# EAGLE board AM3352-TI (EAGLE 9.6.2), part 1 of 3
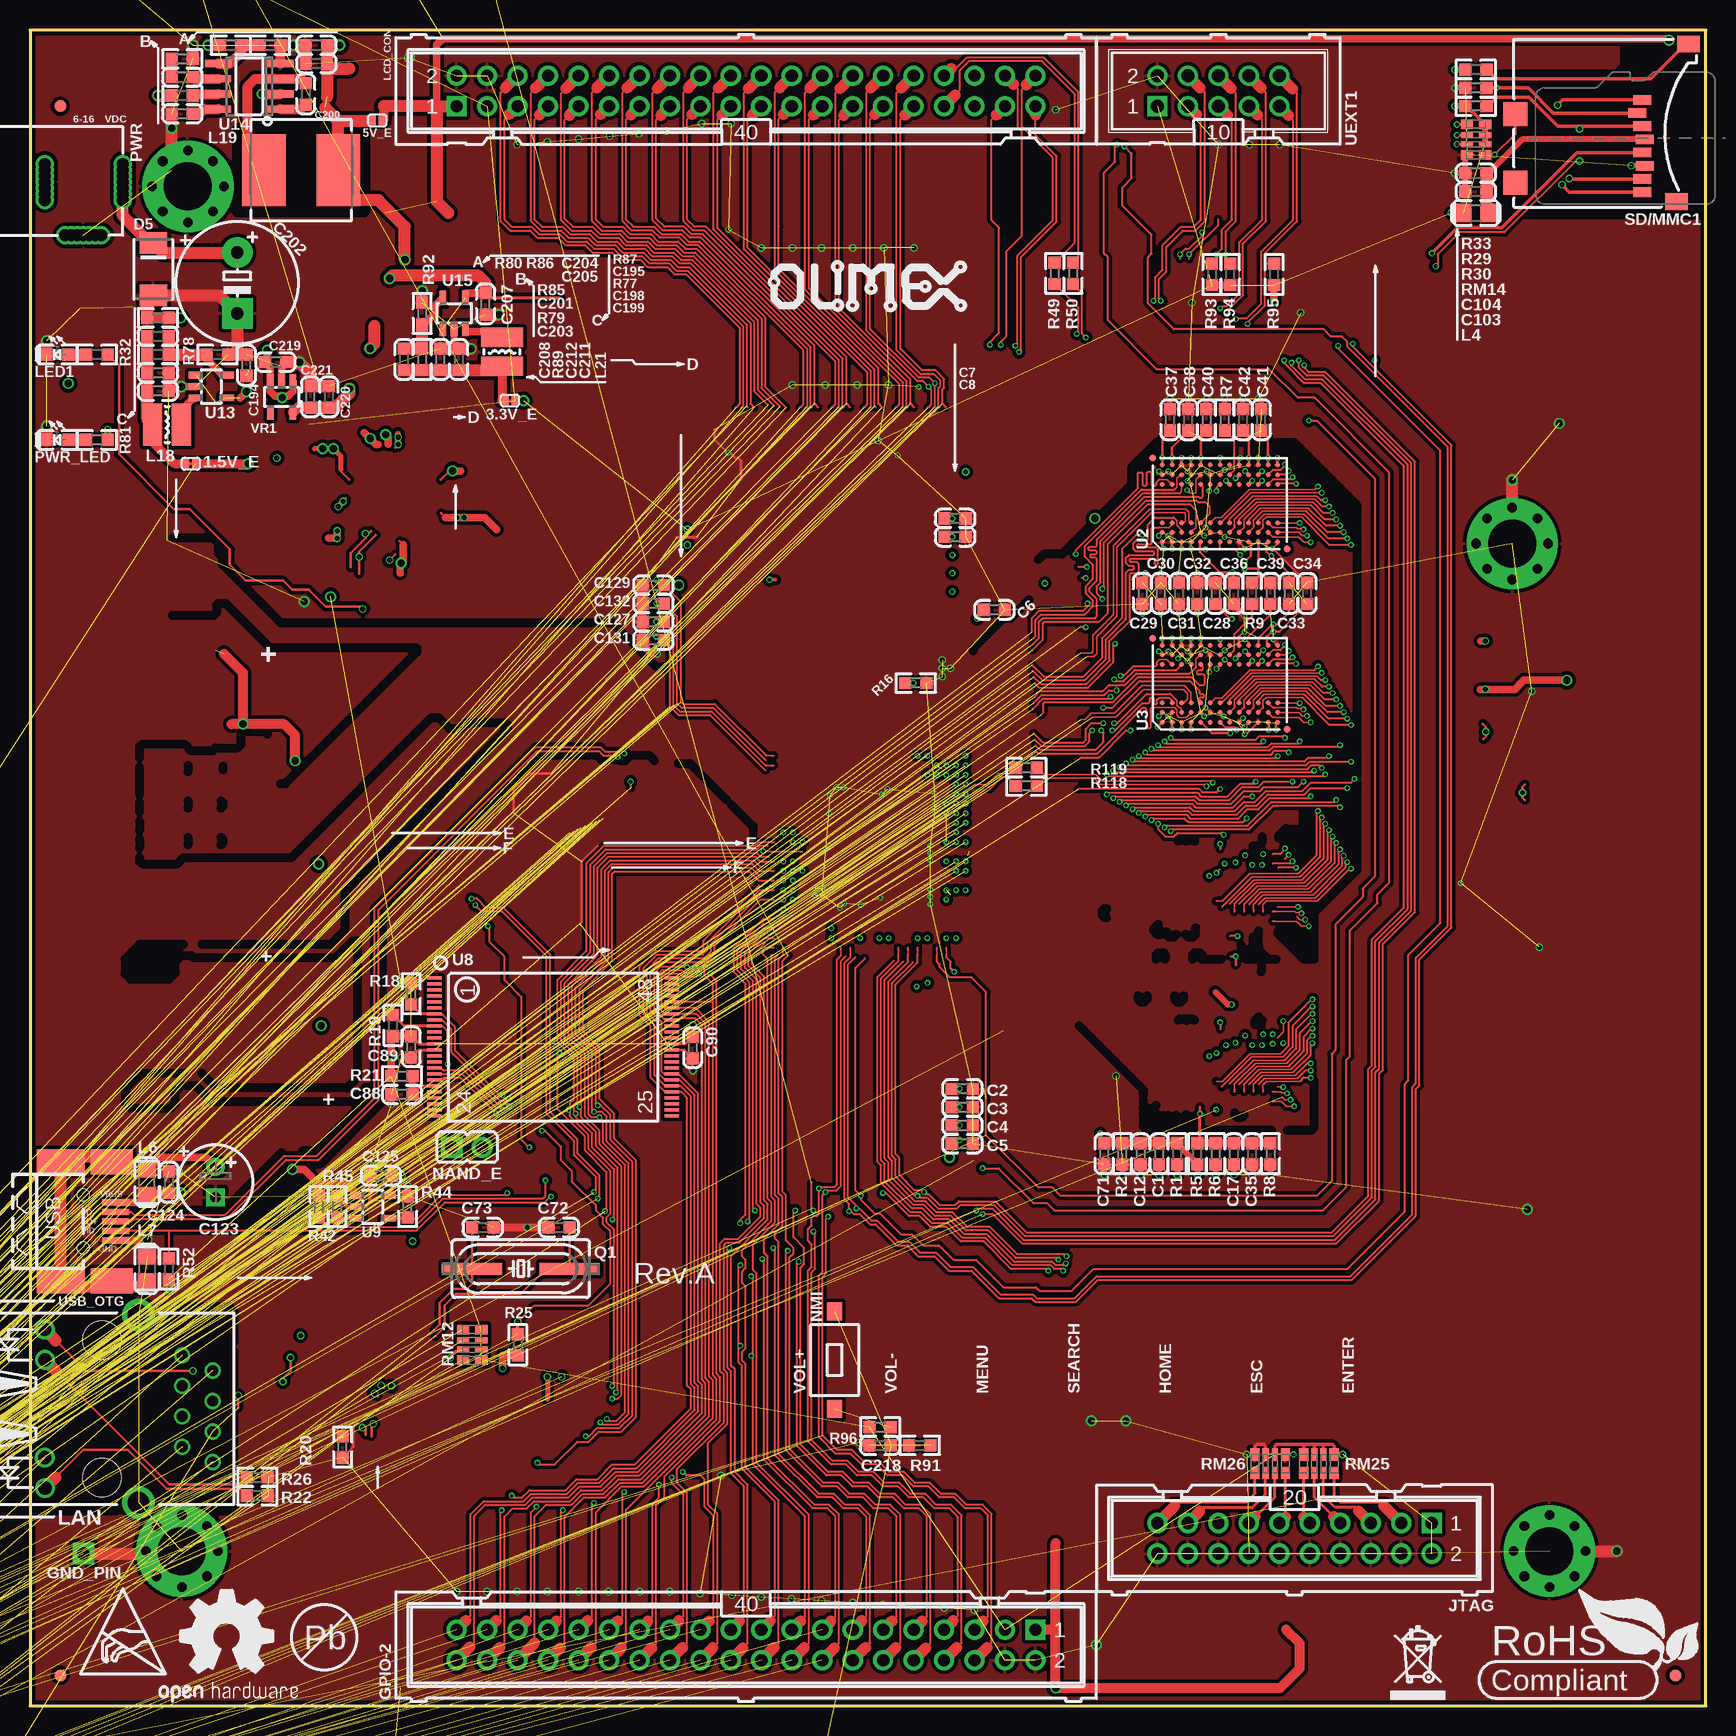
[diagram p5: board, top side]
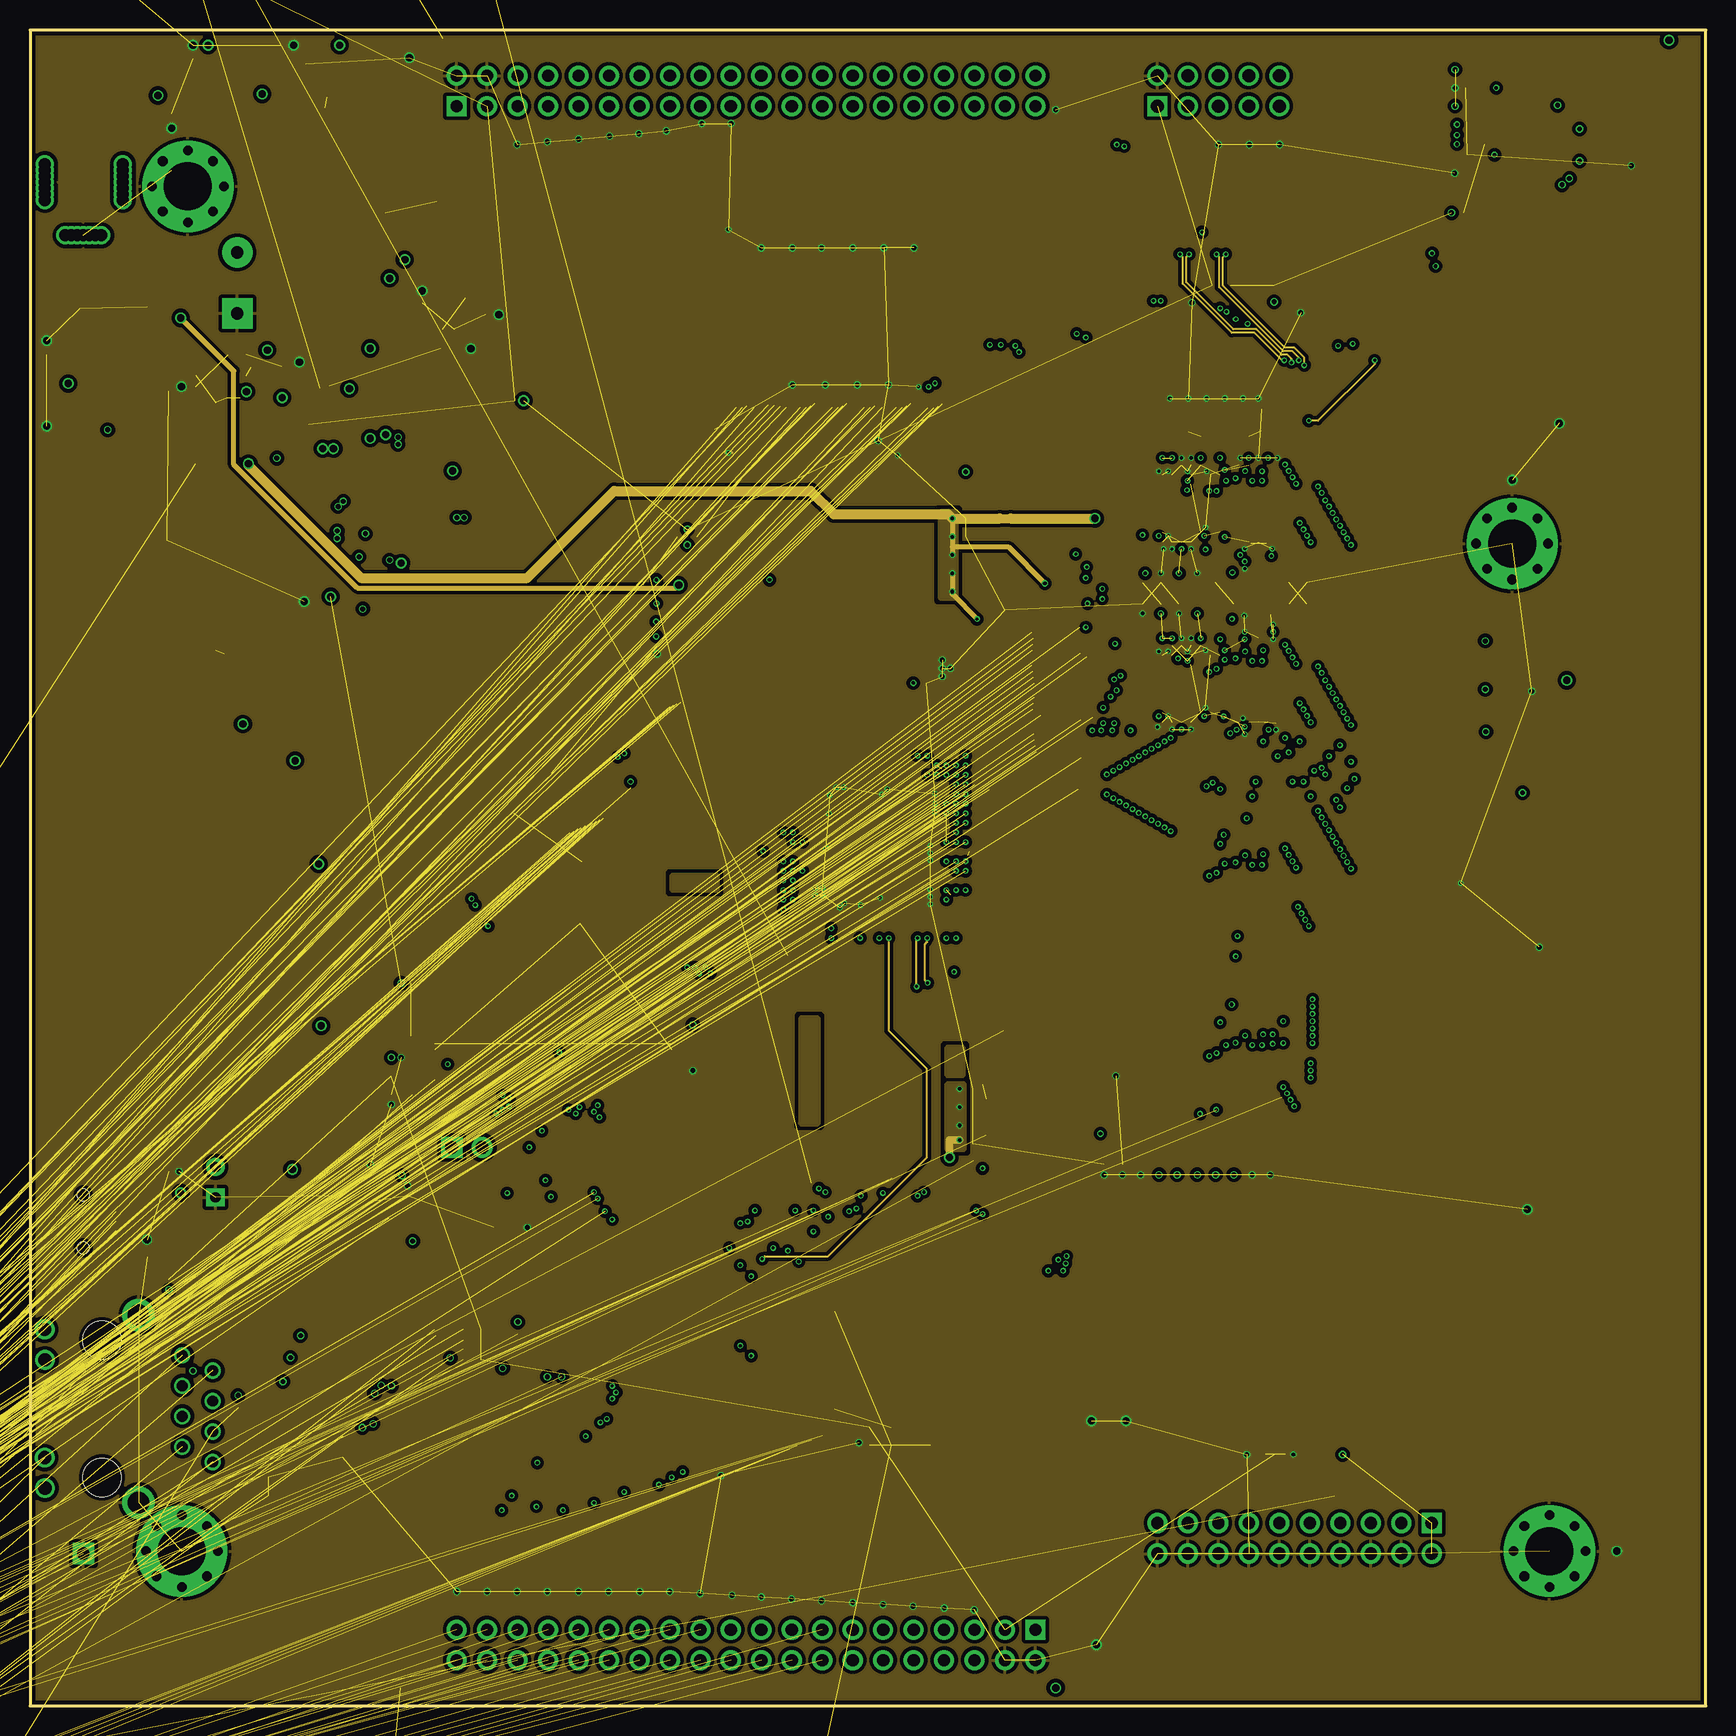
[diagram p6: board, inner layer Route2]
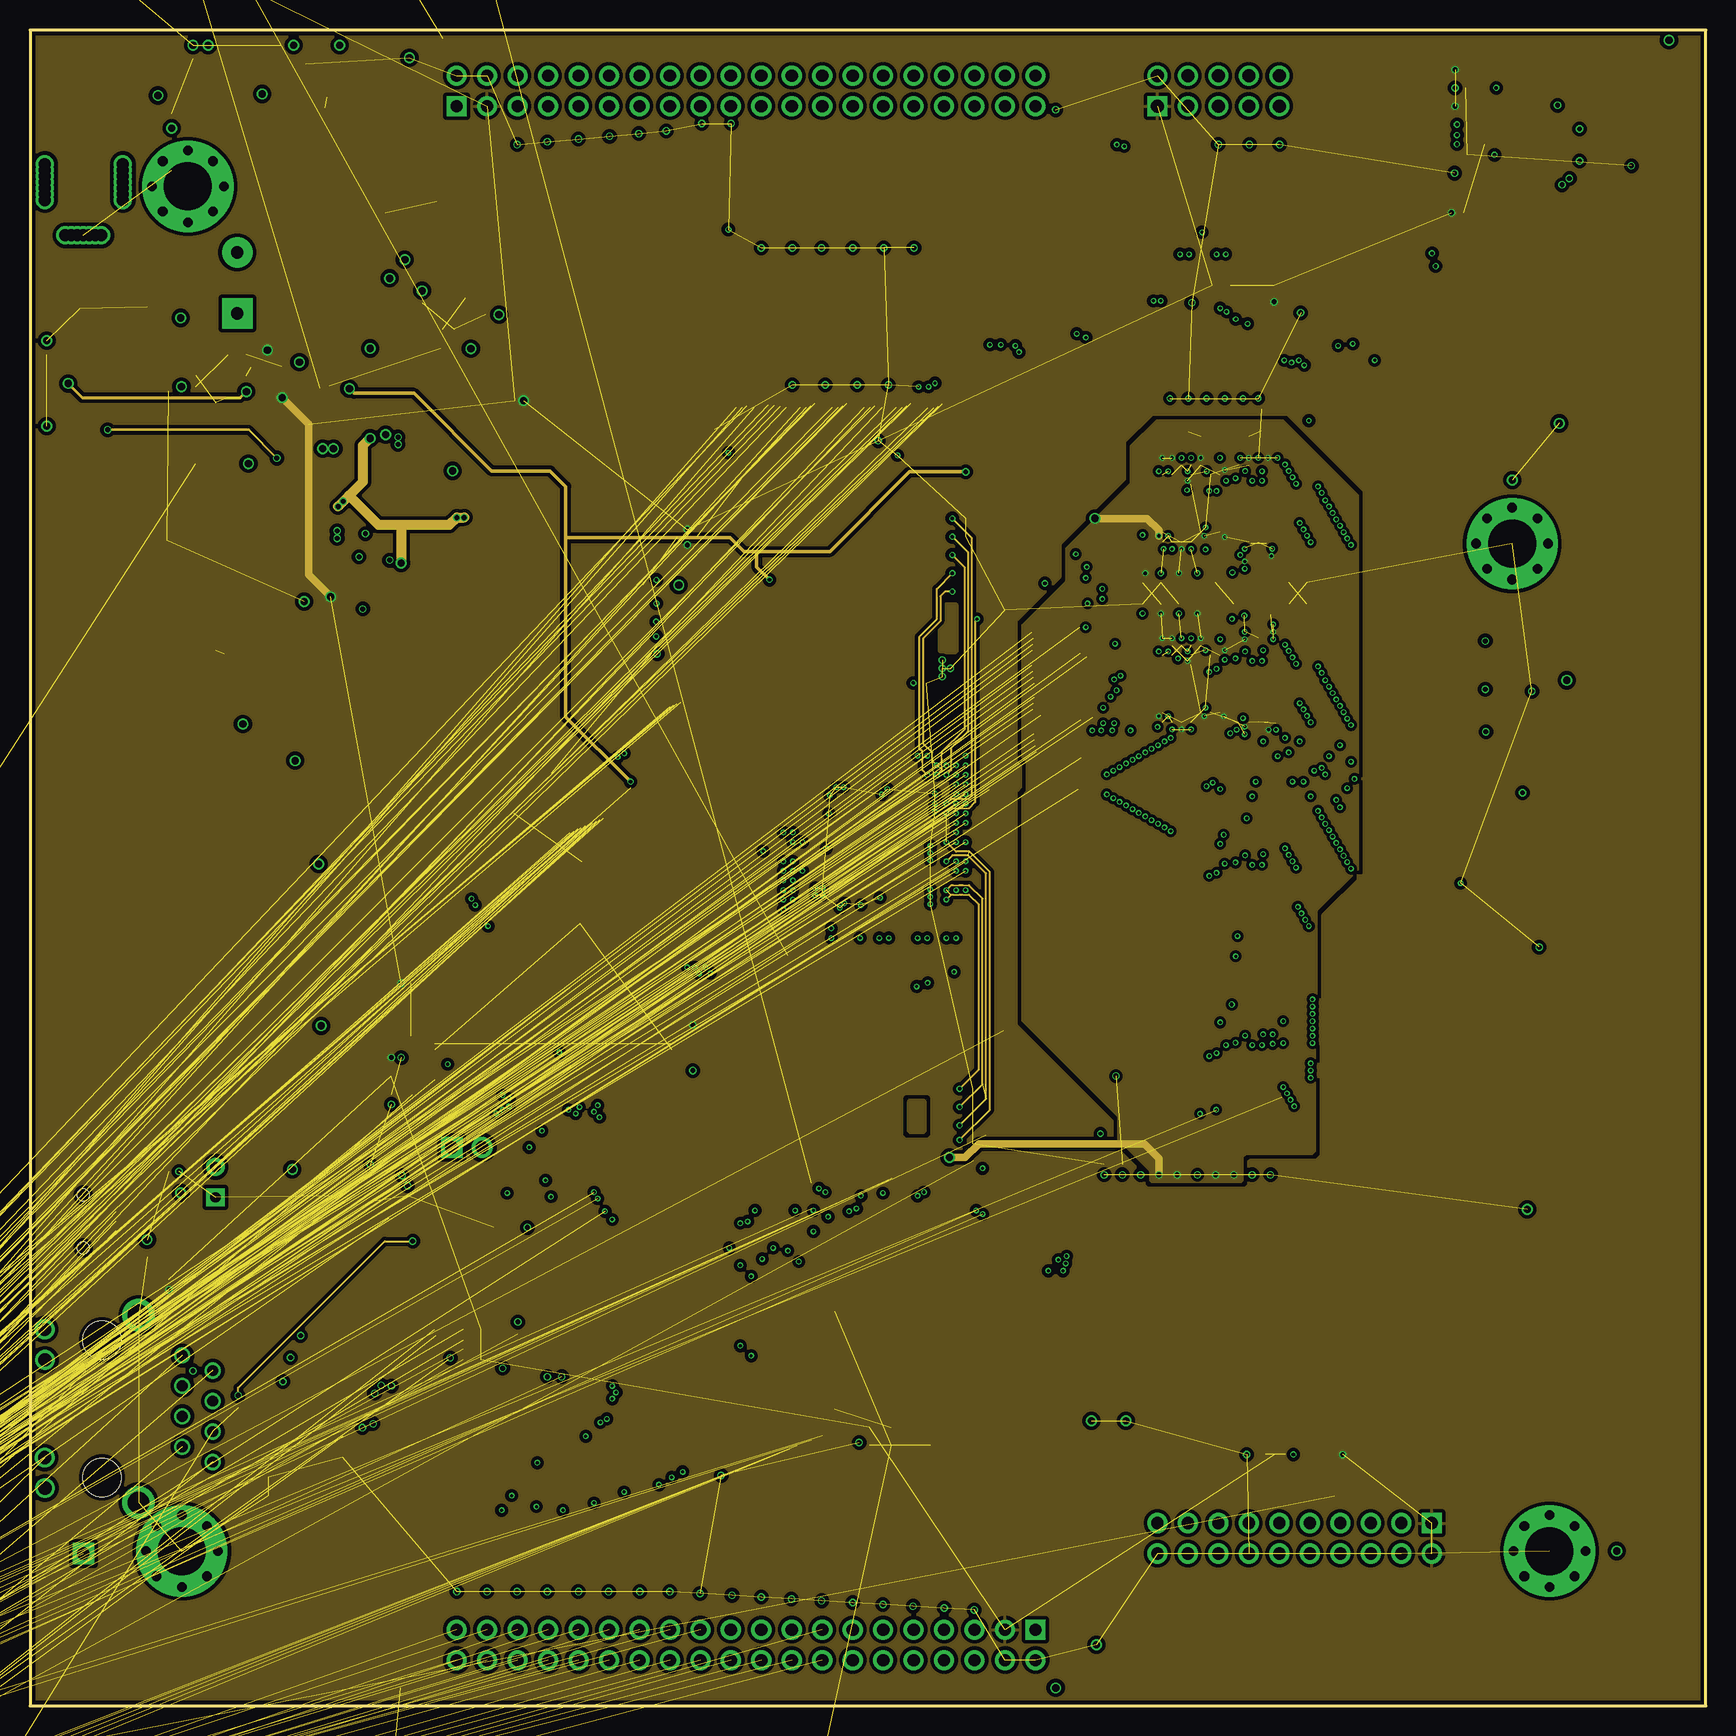
[diagram p7: board, inner layer Route15]
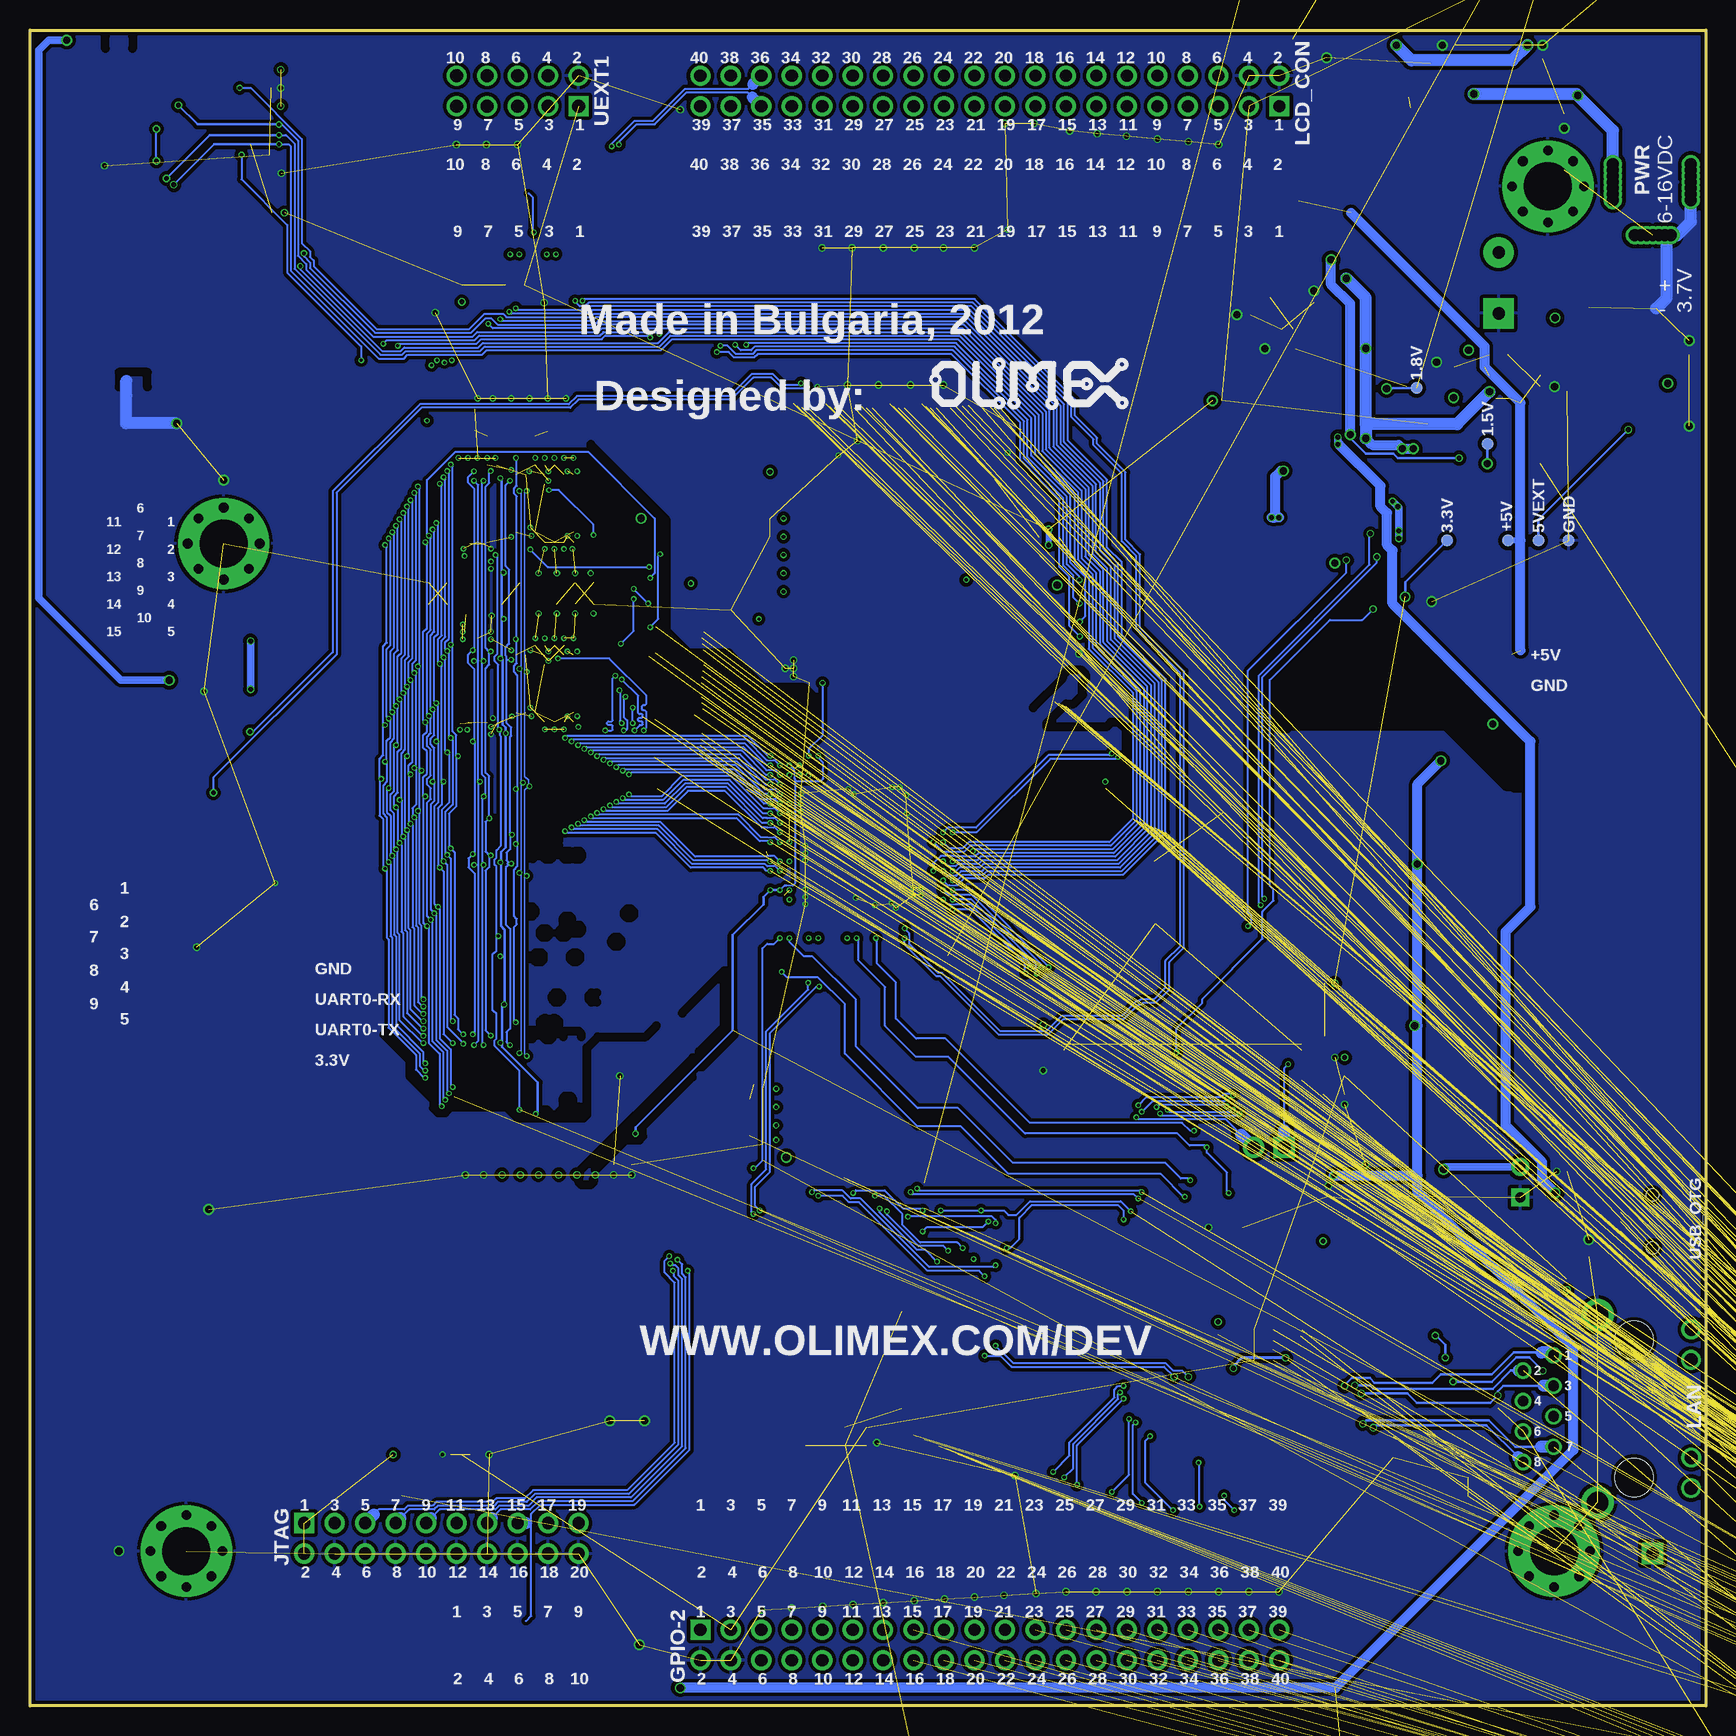
[diagram p8: board, bottom side, seen from below]

Size 139.7 x 139.7 mm. Coordinates in mm from the lower left corner, seen from the top.
Copper layers (1*2*15*16): Top 0.018mm / dielectric 0.12mm / Route2 0.035mm / dielectric 1.2mm / Route15 0.035mm / dielectric 0.12mm / Bottom 0.018mm
Design rules "default": minimum track width 4.5mil, minimum drill 10mil, track to track 5mil, track to pad 5mil, pad to pad 5mil, via to via 5mil, smd to smd 1mil, copper to edge 10mil, drill to drill 8mil, minimum pad ring 6mil, minimum via ring 4mil, stop-mask expansion 4mil, vias tented up to drill 25mil, thermal gap 12mil
tKeepout: 1 lines
tRestrict: 391 lines
bRestrict: 505 lines

## Footprints (pad centres in the part's own frame; a part is rotated, then mirrored left to right if it is on the bottom)
TESTPAD_40-ROUND = smd 1.016 x 1.016: 1 0,0
SJ_1_SMALLER_CLOSE = smd 0.508 x 0.762: 1 -0.381,0; 2 0.381,0
SJ_1_SMALLER = smd 0.508 x 0.762: 1 -0.381,0; 2 0.381,0
C0603_DWS = smd 1.016 x 1.016: 1 -0.889,0; 2 0.889,0
E2,5-6,3 = drill 0.864 pad 1.524: + -1.27,0 | drill 0.864 pad 1.524 square: - 1.27,0
E5-10,5 = drill 1.016 pad 2.54: + -2.54,0 | drill 1.016 pad 2.54 square: - 2.54,0
F09HP-MALE = drill 1.092 pad 1.778: 1 5.486,-1.27; 2 2.743,-1.27; 3 0,-1.27; 4 -2.743,-1.27; 5 -5.486,-1.27; 6 4.115,1.27; 7 1.372,1.27; 8 -1.372,1.27; 9 -4.115,1.27 | drill 3.302 pad 5.08: G1 -12.522,0; G2 12.522,0
SJ = smd 1.168 x 1.6: 1 -0.762,0; 2 0.762,0
SOT23C(BAT54S) = smd 1 x 1.4: 1 -0.95,-1.1; 2 0.95,-1.1; 3 0,1.1
MELF-MLL41 = smd 1.45 x 2.6: 1 -2.445,0; 2 2.445,0
DO214AA = smd 1.778 x 2.286: A 2.177,0; C -2.177,0
SOT23 = smd 1 x 1.4: 1 -0.95,-1.1; 2 0.95,-1.1; 3 0,1.1
TEST_PAD40/70/SQUARE = drill 1.016 pad 1.778 square: P$1 0,0
ML26 = drill 1.016 pad 1.676 square: 1 -15.24,-1.27 | drill 1.016 pad 1.676: 2 -15.24,1.27; 3 -12.7,-1.27; 4 -12.7,1.27; 5 -10.16,-1.27; 6 -10.16,1.27; 7 -7.62,-1.27; 8 -7.62,1.27; 9 -5.08,-1.27; 10 -5.08,1.27; 11 -2.54,-1.27; 12 -2.54,1.27; 13 0,-1.27; 14 0,1.27; 15 2.54,-1.27; 16 2.54,1.27; 17 5.08,-1.27; 18 5.08,1.27; 19 7.62,-1.27; 20 7.62,1.27; 21 10.16,-1.27; 22 10.16,1.27; 23 12.7,-1.27; 24 12.7,1.27; 25 15.24,-1.27; 26 15.24,1.27
ML40 = drill 1.016 pad 1.676 square: 1 -24.13,-1.27 | drill 1.016 pad 1.676: 2 -24.13,1.27; 3 -21.59,-1.27; 4 -21.59,1.27; 5 -19.05,-1.27; 6 -19.05,1.27; 7 -16.51,-1.27; 8 -16.51,1.27; 9 -13.97,-1.27; 10 -13.97,1.27; 11 -11.43,-1.27; 12 -11.43,1.27; 13 -8.89,-1.27; 14 -8.89,1.27; 15 -6.35,-1.27; 16 -6.35,1.27; 17 -3.81,-1.27; 18 -3.81,1.27; 19 -1.27,-1.27; 20 -1.27,1.27; 21 1.27,-1.27; 22 1.27,1.27; 23 3.81,-1.27; 24 3.81,1.27; 25 6.35,-1.27; 26 6.35,1.27; 27 8.89,-1.27; 28 8.89,1.27; 29 11.43,-1.27; 30 11.43,1.27; 31 13.97,-1.27; 32 13.97,1.27; 33 16.51,-1.27; 34 16.51,1.27; 35 19.05,-1.27; 36 19.05,1.27; 37 21.59,-1.27; 38 21.59,1.27; 39 24.13,-1.27; 40 24.13,1.27
ML20-MALE = drill 1.016 pad 1.676 square: 1 -11.43,-1.27 | drill 1.016 pad 1.676: 2 -11.43,1.27; 3 -8.89,-1.27; 4 -8.89,1.27; 5 -6.35,-1.27; 6 -6.35,1.27; 7 -3.81,-1.27; 8 -3.81,1.27; 9 -1.27,-1.27; 10 -1.27,1.27; 11 1.27,-1.27; 12 1.27,1.27; 13 3.81,-1.27; 14 3.81,1.27; 15 6.35,-1.27; 16 6.35,1.27; 17 8.89,-1.27; 18 8.89,1.27; 19 11.43,-1.27; 20 11.43,1.27
L0805_5MIL_DWS = smd 1.27 x 1.524: 1 -1.016,0; 2 1.016,0
CD32 = smd 3.5 x 1.6: 1 0,1.2; 2 0,-1.2
8X8MM_3131 = smd 3.6 x 6: 1 -3.1,0; 2 3.1,0
RJLBC-060TC1 = drill 0.9: 1 -4.455,6.7; 2 -3.185,9.24; 3 -1.915,6.7; 4 -0.645,9.24; 5 0.625,6.7; 6 1.895,9.24; 7 3.165,6.7; 8 4.435,9.24 | drill 1.1: AG 4.07,-4.773; AY -6.61,-4.773; KG 6.61,-4.748; KY -4.07,-4.748 | drill 1.8: GND1 -7.8,3.05; GND2 7.8,3.05 | hole 3.2: -5.715,0; 5.715,0
LED-0603 = smd 1.016 x 1.016: A 0.889,0; C -0.889,0
JP1 = drill 1.1 pad 1.778 square: 1 0,-1.27 | drill 1.1 pad 1.778: 2 0,1.27
SW-TAKT_6X3.5_SMD = smd 1.27 x 1.524: P$1 0,4.064; P$2 0,-4.064
PWR_JACK_UNI_MILLING = drill 1: + 0,4.75; +1 0,5.25; +2 0,5.75; +3 0,6.25; +4 0,4.25; +5 0,3.75; +6 0,3.25; - -6.5,4.75; -1 -6.5,5.25; -2 -6.5,5.75; -3 -6.5,4.25; -4 -6.5,3.75; -5 -6.5,6.25; -6 -6.5,3.25; -- -3.3,0.3; --1 -3.8,0.3; --2 -4.3,0.3; --3 -4.8,0.3; --4 -2.8,0.3; --5 -2.3,0.3; --6 -1.8,0.3
HC49/SMD2_THIN = smd 5 x 1: 1 -4.064,0; 2 4.064,0
TC26H_3_REPAIR_SMD = smd 1.27 x 1.778: 1 -1.27,0; 2 1.27,0 | smd 2.54 x 1.27: GND 0,7.874
R0603_5MIL_DWS = smd 1.016 x 1.016: 1 -0.889,0; 2 0.889,0
0603_0R = smd 1.016 x 1.016: 1 -0.889,0; 2 0.889,0
R1206_5MIL_WS = smd 1.651 x 1.778: 1 -1.46,0; 2 1.46,0
R0603_5MIL_DWS_NA = smd 1.016 x 1.016: 1 -0.889,0; 2 0.889,0
R_MATRIX_4 = smd 1.016 x 0.762: 1.1 -0.762,1.27; 1.2 0.762,1.27; 4.1 -0.762,-1.27; 4.2 0.762,-1.27 | smd 1.016 x 0.508: 2.1 -0.762,0.381; 2.2 0.762,0.381; 3.1 -0.762,-0.381; 3.2 0.762,-0.381
TFR-MEM-CON = smd 0.8 x 1.5: 1 -3.2,10.7; 2 -2.1,10.3; 3 -1,10.7; 4 0.1,10.9; 5 1.2,10.7; 6 2.3,10.9; 7 3.4,10.7; 8 4.5,10.7 | smd 2 x 2: 9 3.7,0.1; 10 -2,0.1 | smd 1.4 x 1.9: 11 5.3,13.55; 12 -7.85,14.55
SOT-23 = smd 1 x 1.4: 1 -0.95,-1.1; 2 0.95,-1.1; 3 0,1.1
S-PBGA-N324 = smd 0.5 x 0.5: A1 -6.8,6.8; A2 -6,6.8; A3 -5.2,6.8; A4 -4.4,6.8; A5 -3.6,6.8; A6 -2.8,6.8; A7 -2,6.8; A8 -1.2,6.8; A9 -0.4,6.8; A10 0.4,6.8; A11 1.2,6.8; A12 2,6.8; A13 2.8,6.8; A14 3.6,6.8; A15 4.4,6.8; A16 5.2,6.8; A17 6,6.8; A18 6.8,6.8; B1 -6.8,6; B2 -6,6; B3 -5.2,6; B4 -4.4,6; B5 -3.6,6; B6 -2.8,6; B7 -2,6; B8 -1.2,6; B9 -0.4,6; B10 0.4,6; B11 1.2,6; B12 2,6; B13 2.8,6; B14 3.6,6; B15 4.4,6; B16 5.2,6; B17 6,6; B18 6.8,6; C1 -6.8,5.2; C2 -6,5.2; C3 -5.2,5.2; C4 -4.4,5.2; C5 -3.6,5.2; C6 -2.8,5.2; C7 -2,5.2; C8 -1.2,5.2; C9 -0.4,5.2; C10 0.4,5.2; C11 1.2,5.2; C12 2,5.2; C13 2.8,5.2; C14 3.6,5.2; C15 4.4,5.2; C16 5.2,5.2; C17 6,5.2; C18 6.8,5.2; D1 -6.8,4.4; D2 -6,4.4; D3 -5.2,4.4; D4 -4.4,4.4; D5 -3.6,4.4; D6 -2.8,4.4; D7 -2,4.4; D8 -1.2,4.4; D9 -0.4,4.4; D10 0.4,4.4; D11 1.2,4.4; D12 2,4.4; D13 2.8,4.4; D14 3.6,4.4; D15 4.4,4.4; D16 5.2,4.4; D17 6,4.4; D18 6.8,4.4; E1 -6.8,3.6; E2 -6,3.6; E3 -5.2,3.6; E4 -4.4,3.6; E5 -3.6,3.6; E6 -2.8,3.6; E7 -2,3.6; E8 -1.2,3.6; E9 -0.4,3.6; E10 0.4,3.6; E11 1.2,3.6; E12 2,3.6; E13 2.8,3.6; E14 3.6,3.6; E15 4.4,3.6; E16 5.2,3.6; E17 6,3.6; E18 6.8,3.6; F1 -6.8,2.8; F2 -6,2.8; F3 -5.2,2.8; F4 -4.4,2.8; F5 -3.6,2.8; F6 -2.8,2.8; F7 -2,2.8; F8 -1.2,2.8; F9 -0.4,2.8; F10 0.4,2.8; F11 1.2,2.8; F12 2,2.8; F13 2.8,2.8; F14 3.6,2.8; F15 4.4,2.8; F16 5.2,2.8; F17 6,2.8; F18 6.8,2.8; G1 -6.8,2; G2 -6,2; G3 -5.2,2; G4 -4.4,2; G5 -3.6,2; G6 -2.8,2; G7 -2,2; G8 -1.2,2; G9 -0.4,2; G10 0.4,2; G11 1.2,2; G12 2,2; G13 2.8,2; G14 3.6,2; G15 4.4,2; G16 5.2,2; G17 6,2; G18 6.8,2; H1 -6.8,1.2; H2 -6,1.2; H3 -5.2,1.2; H4 -4.4,1.2; H5 -3.6,1.2; H6 -2.8,1.2; H7 -2,1.2; H8 -1.2,1.2; H9 -0.4,1.2; H10 0.4,1.2; H11 1.2,1.2; H12 2,1.2; H13 2.8,1.2; H14 3.6,1.2; H15 4.4,1.2; H16 5.2,1.2; H17 6,1.2; H18 6.8,1.2; J1 -6.8,0.4; J2 -6,0.4; J3 -5.2,0.4; J4 -4.4,0.4; J5 -3.6,0.4; J6 -2.8,0.4; J7 -2,0.4; J8 -1.2,0.4; J9 -0.4,0.4; J10 0.4,0.4; J11 1.2,0.4; J12 2,0.4; J13 2.8,0.4; J14 3.6,0.4; J15 4.4,0.4; J16 5.2,0.4; J17 6,0.4; J18 6.8,0.4; K1 -6.8,-0.4; K2 -6,-0.4; K3 -5.2,-0.4; K4 -4.4,-0.4; K5 -3.6,-0.4; K6 -2.8,-0.4; K7 -2,-0.4; K8 -1.2,-0.4; K9 -0.4,-0.4; K10 0.4,-0.4; K11 1.2,-0.4; K12 2,-0.4; K13 2.8,-0.4; K14 3.6,-0.4; K15 4.4,-0.4; K16 5.2,-0.4; K17 6,-0.4; K18 6.8,-0.4; L1 -6.8,-1.2; L2 -6,-1.2; L3 -5.2,-1.2; L4 -4.4,-1.2; L5 -3.6,-1.2; L6 -2.8,-1.2; L7 -2,-1.2; L8 -1.2,-1.2; L9 -0.4,-1.2; L10 0.4,-1.2; L11 1.2,-1.2; L12 2,-1.2; L13 2.8,-1.2; L14 3.6,-1.2; L15 4.4,-1.2; L16 5.2,-1.2; L17 6,-1.2; L18 6.8,-1.2; M1 -6.8,-2; M2 -6,-2; M3 -5.2,-2; M4 -4.4,-2; M5 -3.6,-2; M6 -2.8,-2; M7 -2,-2; M8 -1.2,-2; M9 -0.4,-2; M10 0.4,-2; M11 1.2,-2; M12 2,-2; M13 2.8,-2; M14 3.6,-2; M15 4.4,-2; M16 5.2,-2; M17 6,-2; M18 6.8,-2; N1 -6.8,-2.8; N2 -6,-2.8; N3 -5.2,-2.8; N4 -4.4,-2.8; N5 -3.6,-2.8; N6 -2.8,-2.8; N7 -2,-2.8; N8 -1.2,-2.8; N9 -0.4,-2.8; N10 0.4,-2.8; N11 1.2,-2.8; N12 2,-2.8; N13 2.8,-2.8; N14 3.6,-2.8; N15 4.4,-2.8; N16 5.2,-2.8; N17 6,-2.8; N18 6.8,-2.8; P1 -6.8,-3.6; P2 -6,-3.6; P3 -5.2,-3.6; P4 -4.4,-3.6; P5 -3.6,-3.6; P6 -2.8,-3.6; P7 -2,-3.6; P8 -1.2,-3.6; P9 -0.4,-3.6; P10 0.4,-3.6; P11 1.2,-3.6; P12 2,-3.6; P13 2.8,-3.6; P14 3.6,-3.6; P15 4.4,-3.6; P16 5.2,-3.6; P17 6,-3.6; P18 6.8,-3.6; R1 -6.8,-4.4; R2 -6,-4.4; R3 -5.2,-4.4; R4 -4.4,-4.4; R5 -3.6,-4.4; R6 -2.8,-4.4; R7 -2,-4.4; R8 -1.2,-4.4; R9 -0.4,-4.4; R10 0.4,-4.4; R11 1.2,-4.4; R12 2,-4.4; R13 2.8,-4.4; R14 3.6,-4.4; R15 4.4,-4.4; R16 5.2,-4.4; R17 6,-4.4; R18 6.8,-4.4; T1 -6.8,-5.2; T2 -6,-5.2; T3 -5.2,-5.2; T4 -4.4,-5.2; T5 -3.6,-5.2; T6 -2.8,-5.2; T7 -2,-5.2; T8 -1.2,-5.2; T9 -0.4,-5.2; T10 0.4,-5.2; T11 1.2,-5.2; T12 2,-5.2; T13 2.8,-5.2; T14 3.6,-5.2; T15 4.4,-5.2; T16 5.2,-5.2; T17 6,-5.2; T18 6.8,-5.2; U1 -6.8,-6; U2 -6,-6; U3 -5.2,-6; U4 -4.4,-6; U5 -3.6,-6; U6 -2.8,-6; U7 -2,-6; U8 -1.2,-6; U9 -0.4,-6; U10 0.4,-6; U11 1.2,-6; U12 2,-6; U13 2.8,-6; U14 3.6,-6; U15 4.4,-6; U16 5.2,-6; U17 6,-6; U18 6.8,-6; V1 -6.8,-6.8; V2 -6,-6.8; V3 -5.2,-6.8; V4 -4.4,-6.8; V5 -3.6,-6.8; V6 -2.8,-6.8; V7 -2,-6.8; V8 -1.2,-6.8; V9 -0.4,-6.8; V10 0.4,-6.8; V11 1.2,-6.8; V12 2,-6.8; V13 2.8,-6.8; V14 3.6,-6.8; V15 4.4,-6.8; V16 5.2,-6.8; V17 6,-6.8; V18 6.8,-6.8 | smd 0.7 x 0.7: FID1 -8,-8; FID2 8,8; FID3 8,-8
FBGA78 = smd 0.4 x 0.4: A1 -3.2,4.8; A2 -2.4,4.8; A3 -1.6,4.8; A7 1.6,4.8; A8 2.4,4.8; A9 3.2,4.8; B1 -3.2,4; B2 -2.4,4; B3 -1.6,4; B7 1.6,4; B8 2.4,4; B9 3.2,4; C1 -3.2,3.2; C2 -2.4,3.2; C3 -1.6,3.2; C7 1.6,3.2; C8 2.4,3.2; C9 3.2,3.2; D1 -3.2,2.4; D2 -2.4,2.4; D3 -1.6,2.4; D7 1.6,2.4; D8 2.4,2.4; D9 3.2,2.4; E1 -3.2,1.6; E2 -2.4,1.6; E3 -1.6,1.6; E7 1.6,1.6; E8 2.4,1.6; E9 3.2,1.6; F1 -3.2,0.8; F2 -2.4,0.8; F3 -1.6,0.8; F7 1.6,0.8; F8 2.4,0.8; F9 3.2,0.8; G1 -3.2,0; G2 -2.4,0; G3 -1.6,0; G7 1.6,0; G8 2.4,0; G9 3.2,0; H1 -3.2,-0.8; H2 -2.4,-0.8; H3 -1.6,-0.8; H7 1.6,-0.8; H8 2.4,-0.8; H9 3.2,-0.8; J1 -3.2,-1.6; J2 -2.4,-1.6; J3 -1.6,-1.6; J7 1.6,-1.6; J8 2.4,-1.6; J9 3.2,-1.6; K1 -3.2,-2.4; K2 -2.4,-2.4; K3 -1.6,-2.4; K7 1.6,-2.4; K8 2.4,-2.4; K9 3.2,-2.4; L1 -3.2,-3.2; L2 -2.4,-3.2; L3 -1.6,-3.2; L7 1.6,-3.2; L8 2.4,-3.2; L9 3.2,-3.2; M1 -3.2,-4; M2 -2.4,-4; M3 -1.6,-4; M7 1.6,-4; M8 2.4,-4; M9 3.2,-4; N1 -3.2,-4.8; N2 -2.4,-4.8; N3 -1.6,-4.8; N7 1.6,-4.8; N8 2.4,-4.8; N9 3.2,-4.8 | smd 0.6 x 0.6: FID1 -3.8,-5.6; FID2 3.8,5.6
QFN-32 = smd 0.25 x 0.75: 1 -1.75,-2.425; 2 -1.25,-2.425; 3 -0.75,-2.425; 4 -0.25,-2.425; 5 0.25,-2.425; 6 0.75,-2.425; 7 1.25,-2.425; 8 1.75,-2.425; 17 1.75,2.425; 18 1.25,2.425; 19 0.75,2.425; 20 0.25,2.425; 21 -0.25,2.425; 22 -0.75,2.425; 23 -1.25,2.425; 24 -1.75,2.425 | smd 0.75 x 0.25: 9 2.425,-1.75; 10 2.425,-1.25; 11 2.425,-0.75; 12 2.425,-0.25; 13 2.425,0.25; 14 2.425,0.75; 15 2.425,1.25; 16 2.425,1.75; 25 -2.425,1.75; 26 -2.425,1.25; 27 -2.425,0.75; 28 -2.425,0.25; 29 -2.425,-0.25; 30 -2.425,-0.75; 31 -2.425,-1.25; 32 -2.425,-1.75 | smd 3.2 x 3.2: EXP_PAD 0,0
PW = smd 0.3 x 1.5: 1 -2.925,-3; 2 -2.275,-3; 3 -1.625,-3; 4 -0.975,-3; 5 -0.325,-3; 6 0.325,-3; 7 0.975,-3; 8 1.625,-3; 9 2.275,-3; 10 2.925,-3; 11 2.925,3; 12 2.275,3; 13 1.625,3; 14 0.975,3; 15 0.325,3; 16 -0.325,3; 17 -0.975,3; 18 -1.625,3; 19 -2.275,3; 20 -2.925,3
TSOP48 = smd 0.25 x 1.2: 1 -5.75,-9.9; 2 -5.25,-9.9; 3 -4.75,-9.9; 4 -4.25,-9.9; 5 -3.75,-9.9; 6 -3.25,-9.9; 7 -2.75,-9.9; 8 -2.25,-9.9; 9 -1.75,-9.9; 10 -1.25,-9.9; 11 -0.75,-9.9; 12 -0.25,-9.9; 13 0.25,-9.9; 14 0.75,-9.9; 15 1.25,-9.9; 16 1.75,-9.9; 17 2.25,-9.9; 18 2.75,-9.9; 19 3.25,-9.9; 20 3.75,-9.9; 21 4.25,-9.9; 22 4.75,-9.9; 23 5.25,-9.9; 24 5.75,-9.9; 25 5.75,9.9; 26 5.25,9.9; 27 4.75,9.9; 28 4.25,9.9; 29 3.75,9.9; 30 3.25,9.9; 31 2.75,9.9; 32 2.25,9.9; 33 1.75,9.9; 34 1.25,9.9; 35 0.75,9.9; 36 0.25,9.9; 37 -0.25,9.9; 38 -0.75,9.9; 39 -1.25,9.9; 40 -1.75,9.9; 41 -2.25,9.9; 42 -2.75,9.9; 43 -3.25,9.9; 44 -3.75,9.9; 45 -4.25,9.9; 46 -4.75,9.9; 47 -5.25,9.9; 48 -5.75,9.9
SOT23-5 = smd 0.55 x 1.2: 1 -0.95,-1.3; 2 0,-1.3; 3 0.95,-1.3; 4 0.95,1.3; 5 -0.95,1.3
SO-08 = smd 0.6 x 2.2: 1 -1.905,-2.6; 2 -0.635,-2.6; 3 0.635,-2.6; 4 1.905,-2.6; 5 1.905,2.6; 6 0.635,2.6; 7 -0.635,2.6; 8 -1.905,2.6
SOIC8 = smd 0.6 x 2.2: 1 -1.905,-2.6; 2 -0.635,-2.6; 3 0.635,-2.6; 4 1.905,-2.6; 5 1.905,2.6; 6 0.635,2.6; 7 -0.635,2.6; 8 -1.905,2.6
FIDUCIAL-1X2 = smd 1 x 1: 1 0,0
SSOP28 = smd 0.35 x 1.75: 1 -4.225,-3.525; 2 -3.575,-3.525; 3 -2.925,-3.525; 4 -2.275,-3.525; 5 -1.625,-3.525; 6 -0.975,-3.525; 7 -0.325,-3.525; 8 0.325,-3.525; 9 0.975,-3.525; 10 1.625,-3.525; 11 2.275,-3.525; 12 2.925,-3.525; 13 3.575,-3.525; 14 4.225,-3.525; 15 4.225,3.525; 16 3.575,3.525; 17 2.925,3.525; 18 2.275,3.525; 19 1.625,3.525; 20 0.975,3.525; 21 0.325,3.525; 22 -0.325,3.525; 23 -0.975,3.525; 24 -1.625,3.525; 25 -2.275,3.525; 26 -2.925,3.525; 27 -3.575,3.525; 28 -4.225,3.525
NANO-ITX_140X140 = drill 4 pad 7.6: GND 12.656,12.906; P$2 13.166,126.666; P$3 126.666,12.906; P$4 123.556,96.886 | drill 0.8: P$11 9.656,12.906; P$12 15.656,12.906; P$13 12.656,15.906; P$14 12.656,9.906; P$15 10.556,10.806; P$16 14.756,10.806; P$17 14.756,15.006; P$18 10.556,15.006; P$20 10.166,126.666; P$21 16.166,126.666; P$22 13.166,129.666; P$23 13.166,123.666; P$24 11.066,124.566; P$25 15.266,124.566; P$26 15.266,128.766; P$27 11.066,128.766; P$29 123.666,12.906; P$30 129.666,12.906; P$31 126.666,15.906; P$32 126.666,9.906; P$33 124.566,10.806; P$34 128.766,10.806; P$35 128.766,15.006; P$36 124.566,15.006; P$38 120.556,96.886; P$39 126.556,96.886; P$40 123.556,99.886; P$41 123.556,93.886; P$42 121.456,94.786; P$43 125.656,94.786; P$44 125.656,98.986; P$45 121.456,98.986
ML10-MALE = drill 1.1 pad 1.676 square: 1 -5.08,-1.27 | drill 1.1 pad 1.676: 2 -5.08,1.27; 3 -2.54,-1.27; 4 -2.54,1.27; 5 0,-1.27; 6 0,1.27; 7 2.54,-1.27; 8 2.54,1.27; 9 5.08,-1.27; 10 5.08,1.27
USB_A_VERTICAL_PTH = drill 1: 1 3.45,12.75; 2 3.45,14.75; 3 3.45,16.75; 4 3.45,18.75 | drill 1.5: P$1 0.6,12.25; P$2 6.3,12.25; P$3 6.3,19.25; P$4 0.6,19.25
USB_MINI_9PIN = smd 2.25 x 0.5: D+ 2.706,0; D- 2.706,0.8; GND 2.706,-1.6; ID 2.706,-0.8; VBUS 2.706,1.6 | smd 4 x 2.1: GND1 -1.9,4.95; GND3 -1.9,-4.95 | smd 3.5 x 2.1: GND2 2.35,4.95; GND4 2.35,-4.95 | hole 1: 0,2.2; 0,-2.2
DB15-F_22MM = drill 0.9 octagon: 1 4.329,6.35 | drill 0.9: 2 2.043,6.35; 3 -0.243,6.35; 4 -2.529,6.35; 5 -4.815,6.35; 6 5.472,3.81; 7 3.186,3.81; 8 0.9,3.81; 9 -1.386,3.81; 10 -3.672,3.81; 11 4.329,1.27; 12 2.043,1.27; 13 -0.243,1.27; 14 -2.529,1.27; 15 -4.815,1.27 | drill 3.302 pad 5.08: GND1 -12.497,3.81; GND2 12.497,3.81
SOT-23-5 = smd 0.55 x 1.2: 1 -0.95,-1.3; 2 0,-1.3; 3 0.95,-1.3; 4 0.95,1.3; 5 -0.95,1.3

## Placement (x,y rotation side)
1.1V  TESTPADTESTPAD_40-ROUND  [TESTPAD_40-ROUND]  -41.15,295.78 0 top  (outside the outline)
1.1V_CPU_E  Close  [SJ_1_SMALLER_CLOSE]  -34.67,295.66 0 top  (outside the outline)
1.5V  TESTPADTESTPAD_40-ROUND  [TESTPAD_40-ROUND]  18.21,105.21 0 bottom
1.5V_E  Close  [SJ_1_SMALLER_CLOSE]  13.41,103.56 0 top
1.8V  TESTPADTESTPAD_40-ROUND  [TESTPAD_40-ROUND]  24.13,109.86 0 bottom
1.25V  TESTPADTESTPAD_40-ROUND  [TESTPAD_40-ROUND]  -41.15,319.28 0 top  (outside the outline)
1.25V_MPU_E  Close  [SJ_1_SMALLER_CLOSE]  -34.67,319.15 0 top  (outside the outline)
3.3V  TESTPADTESTPAD_40-ROUND  [TESTPAD_40-ROUND]  21.59,97.16 0 bottom
3.3V_E  Close  [SJ_1_SMALLER_CLOSE]  40.01,108.81 0 top
5V_E  Open  [SJ_1_SMALLER]  28.96,132.16 0 top
5VEXT  TESTPADTESTPAD_40-ROUND  [TESTPAD_40-ROUND]  13.97,97.16 0 bottom
+5V  TESTPADTESTPAD_40-ROUND  [TESTPAD_40-ROUND]  16.51,97.16 0 bottom
C1  220nF  [C0603_DWS]  94.11,46.02 90 top
C2  220nF  [C0603_DWS]  77.72,51.44 180 top
C3  220nF  [C0603_DWS]  77.72,49.91 180 top
C4  220nF  [C0603_DWS]  77.72,48.39 180 top
C5  220nF  [C0603_DWS]  77.72,46.86 180 top
C6  220nF  [C0603_DWS]  80.39,91.36 180 top
C7  220nF  [C0603_DWS]  77.11,98.98 180 top
C8  220nF  [C0603_DWS]  77.11,97.46 180 top
C9  22uF/6.3V  [C0603_DWS]  -68.58,-36.83 0 top  (outside the outline)
C10  100nF  [C0603_DWS]  -68.58,-196.85 0 top  (outside the outline)
C11  1uF  [C0603_DWS]  -68.58,-231.14 0 top  (outside the outline)
C12  220nF  [C0603_DWS]  92.58,46.02 90 top
C13  22uF/6.3V  [C0603_DWS]  -47.37,289.56 0 top  (outside the outline)
C14  22uF/6.3V  [C0603_DWS]  -38.35,289.56 0 top  (outside the outline)
C15  22pF  [C0603_DWS]  -58.93,295.78 0 top  (outside the outline)
C16  22uF/6.3V  [C0603_DWS]  -49.91,295.78 0 top  (outside the outline)
C17  220nF  [C0603_DWS]  100.36,46.02 90 top
C18  22uF/6.3V  [C0603_DWS]  -47.37,313.06 0 top  (outside the outline)
C19  22uF/6.3V  [C0603_DWS]  -38.35,313.06 0 top  (outside the outline)
C20  22pF  [C0603_DWS]  -58.93,319.28 0 top  (outside the outline)
C21  22uF/6.3V  [C0603_DWS]  -49.91,319.28 0 top  (outside the outline)
C22  220nF  [C0603_DWS]  -59.56,325.5 0 top  (outside the outline)
C23  220nF  [C0603_DWS]  -50.55,325.5 0 top  (outside the outline)
C24  220nF  [C0603_DWS]  -41.53,325.5 0 top  (outside the outline)
C25  220nF  [C0603_DWS]  -59.56,331.72 0 top  (outside the outline)
C26  220nF  [C0603_DWS]  -50.55,331.72 0 top  (outside the outline)
C27  220nF  [C0603_DWS]  -41.53,331.72 0 top  (outside the outline)
C28  220nF  [C0603_DWS]  98.83,92.74 270 top
C29  220nF  [C0603_DWS]  92.74,92.74 90 top
C30  220nF  [C0603_DWS]  94.26,92.74 270 top
C31  220nF  [C0603_DWS]  95.78,92.74 90 top
C32  220nF  [C0603_DWS]  97.31,92.74 270 top
C33  220nF  [C0603_DWS]  104.93,92.74 90 top
C34  220nF  [C0603_DWS]  106.45,92.74 270 top
C35  220nF  [C0603_DWS]  101.88,46.02 90 top
C36  220nF  [C0603_DWS]  100.36,92.74 90 top
C37  220nF  [C0603_DWS]  95.02,107.21 270 top
C38  220nF  [C0603_DWS]  96.55,107.21 270 top
C39  220nF  [C0603_DWS]  103.4,92.74 270 top
C40  220nF  [C0603_DWS]  98.07,107.21 270 top
C41  220nF  [C0603_DWS]  102.64,107.21 270 top
C42  220nF  [C0603_DWS]  101.12,107.21 270 top
C43  10nF  [C0603_DWS]  -68.58,-250.19 0 top  (outside the outline)
C44  100nF  [C0603_DWS]  19.05,-309.88 0 top  (outside the outline)
C45  100nF  [C0603_DWS]  -68.58,-111.76 0 top  (outside the outline)
C46  100nF  [C0603_DWS]  -68.58,-133.35 0 top  (outside the outline)
C47  1uF  [C0603_DWS]  -68.58,-139.7 0 top  (outside the outline)
C48  100nF  [C0603_DWS]  -68.58,-146.05 0 top  (outside the outline)
C49  100nF  [C0603_DWS]  -68.58,-152.4 0 top  (outside the outline)
C50  22uF/6.3V  [C0603_DWS]  -68.58,-158.75 0 top  (outside the outline)
C51  22uF/6.3V  [C0603_DWS]  -68.58,-165.1 0 top  (outside the outline)
C52  22uF/6.3V  [C0603_DWS]  -68.58,-171.45 0 top  (outside the outline)
C53  100nF  [C0603_DWS]  28.07,-309.88 0 top  (outside the outline)
C54  100nF  [C0603_DWS]  37.08,-309.88 0 top  (outside the outline)
C55  10uF/6.3V  [C0603_DWS]  7.62,-399.03 0 top  (outside the outline)
C56  33pF  [C0603_DWS]  16.64,-399.03 0 top  (outside the outline)
C57  220nF  [C0603_DWS]  -59.56,337.95 0 top  (outside the outline)
C58  22uF/6.3V  [C0603_DWS]  -50.55,337.95 0 top  (outside the outline)
C59  220nF  [C0603_DWS]  -68.58,-457.2 0 top  (outside the outline)
C60  220nF  [C0603_DWS]  -68.58,-463.55 0 top  (outside the outline)
C61  220nF  [C0603_DWS]  -59.56,344.17 0 top  (outside the outline)
C62  220nF  [C0603_DWS]  -59.56,350.39 0 top  (outside the outline)
C63  33pF  [C0603_DWS]  25.65,-399.03 0 top  (outside the outline)
C64  10uF/6.3V  [C0603_DWS]  34.67,-399.03 0 top  (outside the outline)
C65  100nF  [C0603_DWS]  -50.16,-405.26 0 top  (outside the outline)
C66  100uF/16V/LOWESR/105C/6.3x11mm_RM2.5  [E2,5-6,3]  -46.86,-383.16 0 top  (outside the outline)
C67  100nF  [C0603_DWS]  -41.15,-405.26 0 top  (outside the outline)
C68  220nF  [C0603_DWS]  -59.56,356.62 0 top  (outside the outline)
C69  220nF  [C0603_DWS]  -59.56,362.84 0 top  (outside the outline)
C70  220nF  [C0603_DWS]  -59.56,369.06 0 top  (outside the outline)
C71  220nF  [C0603_DWS]  89.53,46.02 90 top
C72  33pF  [C0603_DWS]  44.09,39.88 0 top
C73  33pF  [C0603_DWS]  37.74,39.88 180 top
C74  1uF  [C0603_DWS]  -32.13,-405.26 0 top  (outside the outline)
C75  100uF/16V/LOWESR/105C/6.3x11mm_RM2.5  [E2,5-6,3]  -48.13,-420.62 0 top  (outside the outline)
C76  100nF  [C0603_DWS]  -60.45,-443.74 0 top  (outside the outline)
C77  220nF  [C0603_DWS]  -59.56,375.29 0 top  (outside the outline)
C78  220nF  [C0603_DWS]  -59.56,381.51 0 top  (outside the outline)
C79  220nF  [C0603_DWS]  -59.56,387.73 0 top  (outside the outline)
C80  220nF  [C0603_DWS]  -59.56,393.95 0 top  (outside the outline)
C81  220nF  [C0603_DWS]  -59.56,400.18 0 top  (outside the outline)
C82  220nF  [C0603_DWS]  -59.56,406.4 0 top  (outside the outline)
C83  220nF  [C0603_DWS]  -59.56,412.62 0 top  (outside the outline)
C84  220nF  [C0603_DWS]  -59.56,418.85 0 top  (outside the outline)
C85  220nF  [C0603_DWS]  -59.56,425.07 0 top  (outside the outline)
C86  100nF  [C0603_DWS]  -42.42,185.17 0 top  (outside the outline)
C87  220nF  [C0603_DWS]  -59.56,191.39 0 top  (outside the outline)
C88  NA(100nF)  [C0603_DWS]  31.01,50.98 0 top
C89  NA(100nF)  [C0603_DWS]  31.78,54.94 90 top
C90  NA(100nF)  [C0603_DWS]  55.24,54.86 90 top
C91  100uF/16V/LOWESR/105C/6.3x11mm_RM2.5  [E2,5-6,3]  -28.96,-383.16 0 top  (outside the outline)
C92  NA(220nF)  [C0603_DWS]  -68.58,-647.7 0 top  (outside the outline)
C93  220nF  [C0603_DWS]  -50.55,191.39 0 top  (outside the outline)
C94  220nF  [C0603_DWS]  -41.53,191.39 0 top  (outside the outline)
C95  220nF  [C0603_DWS]  -59.56,197.61 0 top  (outside the outline)
C96  220nF  [C0603_DWS]  -50.55,197.61 0 top  (outside the outline)
C97  10pF  [C0603_DWS]  -50.42,-218.31 0 top  (outside the outline)
C98  10pF  [C0603_DWS]  -41.4,-218.31 0 top  (outside the outline)
C99  33pF  [C0603_DWS]  -32.38,-218.31 0 top  (outside the outline)
C100  33pF  [C0603_DWS]  -23.37,-218.31 0 top  (outside the outline)
C101  100nF  [C0603_DWS]  -5.08,-405.26 0 top  (outside the outline)
C102  10nF  [C0603_DWS]  -41.4,-224.54 0 top  (outside the outline)
C103  22uF/6.3V  [C0603_DWS]  120.52,126.24 0 top
C104  22uF/6.3V  [C0603_DWS]  120.52,127.76 0 top
C105  100nF  [C0603_DWS]  3.94,-405.26 0 top  (outside the outline)
C106  220nF  [C0603_DWS]  -41.53,197.61 0 top  (outside the outline)
C107  100uF/16V/LOWESR/105C/6.3x11mm_RM2.5  [E2,5-6,3]  -11.05,-383.16 0 top  (outside the outline)
C108  100nF  [C0603_DWS]  12.95,-405.26 0 top  (outside the outline)
C109  10uF/6.3V  [C0603_DWS]  21.97,-405.26 0 top  (outside the outline)
C110  100nF  [C0603_DWS]  30.99,-405.26 0 top  (outside the outline)
C111  100nF  [C0603_DWS]  40.01,-405.26 0 top  (outside the outline)
C112  100nF  [C0603_DWS]  -50.16,-411.48 0 top  (outside the outline)
C113  220nF  [C0603_DWS]  -59.56,203.84 0 top  (outside the outline)
C114  22uF/6.3V  [C0603_DWS]  -50.55,203.84 0 top  (outside the outline)
C115  220nF  [C0603_DWS]  -59.56,210.06 0 top  (outside the outline)
C116  220nF  [C0603_DWS]  -50.55,210.06 0 top  (outside the outline)
C117  220nF  [C0603_DWS]  -59.56,216.28 0 top  (outside the outline)
C118  220nF  [C0603_DWS]  -59.56,222.5 0 top  (outside the outline)
C119  220nF  [C0603_DWS]  -50.55,222.5 0 top  (outside the outline)
C120  220nF  [C0603_DWS]  -59.56,228.73 0 top  (outside the outline)
C121  220nF  [C0603_DWS]  -50.55,228.73 0 top  (outside the outline)
C122  220nF  [C0603_DWS]  -68.58,-590.55 0 top  (outside the outline)
C123  100uF/16V/LOWESR/105C/6.3x11mm_RM2.5  [E2,5-6,3]  15.47,43.66 270 top
C124  100nF  [C0603_DWS]  11.58,43.66 90 top
C125  100nF  [C0603_DWS]  29.26,44.2 180 top
C126  220nF  [C0603_DWS]  -59.56,234.95 0 top  (outside the outline)
C127  1nF  [C0603_DWS]  51.97,90.37 0 top
C128  220nF  [C0603_DWS]  -50.55,234.95 0 top  (outside the outline)
C129  1nF  [C0603_DWS]  51.97,93.42 0 top
C130  220nF  [C0603_DWS]  -59.56,241.17 0 top  (outside the outline)
C131  1nF  [C0603_DWS]  51.97,88.85 0 top
C132  1nF  [C0603_DWS]  51.97,91.9 0 top
C133  220nF  [C0603_DWS]  -59.56,247.4 0 top  (outside the outline)
C134  220nF  [C0603_DWS]  -59.56,253.62 0 top  (outside the outline)
C135  220nF  [C0603_DWS]  -68.58,-450.85 0 top  (outside the outline)
C136  220nF  [C0603_DWS]  -59.56,259.84 0 top  (outside the outline)
C137  220nF  [C0603_DWS]  -50.55,259.84 0 top  (outside the outline)
C138  220nF  [C0603_DWS]  -41.53,259.84 0 top  (outside the outline)
C139  220nF  [C0603_DWS]  -59.56,266.06 0 top  (outside the outline)
C140  220nF  [C0603_DWS]  -50.55,266.06 0 top  (outside the outline)
C141  220nF  [C0603_DWS]  -41.53,266.06 0 top  (outside the outline)
C142  220nF  [C0603_DWS]  -59.56,272.29 0 top  (outside the outline)
C143  22uF/6.3V  [C0603_DWS]  -50.55,272.29 0 top  (outside the outline)
C144  220nF  [C0603_DWS]  -59.56,431.29 0 top  (outside the outline)
C145  220nF  [C0603_DWS]  -59.56,437.51 0 top  (outside the outline)
C146  220nF  [C0603_DWS]  -59.56,443.74 0 top  (outside the outline)
C147  22uF/6.3V  [C0603_DWS]  -59.56,449.96 0 top  (outside the outline)
C148  1uF  [C0603_DWS]  -68.58,-469.9 0 top  (outside the outline)
C149  1uF  [C0603_DWS]  -68.58,-476.25 0 top  (outside the outline)
C150  1uF  [C0603_DWS]  -68.58,-482.6 0 top  (outside the outline)
C151  220nF  [C0603_DWS]  -68.58,-488.95 0 top  (outside the outline)
C152  220nF  [C0603_DWS]  -68.58,-495.3 0 top  (outside the outline)
C153  220nF  [C0603_DWS]  -68.58,-501.65 0 top  (outside the outline)
C154  220nF  [C0603_DWS]  -68.58,-508 0 top  (outside the outline)
C155  220nF  [C0603_DWS]  -68.58,-514.35 0 top  (outside the outline)
C156  220nF  [C0603_DWS]  -68.58,-520.7 0 top  (outside the outline)
C157  22uF/6.3V  [C0603_DWS]  -68.58,-527.05 0 top  (outside the outline)
C158  220nF  [C0603_DWS]  -68.58,-549.91 0 top  (outside the outline)
C159  10nF  [C0603_DWS]  -68.58,-556.26 0 top  (outside the outline)
C160  220nF  [C0603_DWS]  -68.58,-596.9 0 top  (outside the outline)
C161  220nF  [C0603_DWS]  -68.58,-603.25 0 top  (outside the outline)
C162  220nF  [C0603_DWS]  -68.58,-609.6 0 top  (outside the outline)
C163  100nF  [C0603_DWS]  -45.47,513.21 0 top  (outside the outline)
C165  22uF/6.3V  [C0603_DWS]  -48.01,498.22 0 top  (outside the outline)
C166  NA  [C0603_DWS]  -59.56,519.43 0 top  (outside the outline)
C167  NA  [C0603_DWS]  -50.55,519.43 0 top  (outside the outline)
C168  NA  [C0603_DWS]  -59.56,525.65 0 top  (outside the outline)
C169  NA  [C0603_DWS]  -50.55,525.65 0 top  (outside the outline)
C194  22uF/6.3V  [C0603_DWS]  18.03,111.76 90 top
C195  22pF  [C0603_DWS]  10.67,114.17 0 top
C198  22uF/6.3V  [C0603_DWS]  10.67,111.12 0 top
C199  22uF/6.3V  [C0603_DWS]  10.67,109.6 0 top
C200  10nF  [C0603_DWS]  22.99,134.37 90 top
C201  3.3nF  [C0603_DWS]  12.7,135.76 180 top
C202  470uF/25V/LOWESR/105C  [E5-10,5]  17.27,118.62 270 top
C203  100nF  [C0603_DWS]  12.7,132.72 180 top
C204  22uF/6.3V  [C0603_DWS]  23.88,138.43 180 top
C205  22uF/6.3V  [C0603_DWS]  23.88,136.91 180 top
C207  22uF/6.3V  [C0603_DWS]  37.97,116.87 270 top
C208  22pF  [C0603_DWS]  31.17,112.24 90 top
C211  22uF/6.3V  [C0603_DWS]  35.74,112.24 90 top
C212  22uF/6.3V  [C0603_DWS]  34.21,112.24 90 top
C218  100nF  [C0603_DWS]  70.87,21.72 180 top
C219  22uF/6.3V  [C0603_DWS]  20.47,112.01 0 top
C220  22uF/6.3V  [C0603_DWS]  24.92,109.12 90 top
C221  100nF  [C0603_DWS]  23.39,109.12 90 top
CAN  DB9-Male  [F09HP-MALE]  -27.94,157.1 0 top  (outside the outline)
CAN_T  Open  [SJ]  -32.26,178.56 0 top  (outside the outline)
D1  BAT54S  [SOT23C(BAT54S)]  52.7,-257.68 0 top  (outside the outline)
D4  1N4148  [MELF-MLL41]  -66.04,-765.81 0 top  (outside the outline)
D5  SMBJ16A  [DO214AA]  10.29,119.76 270 top
D7  BAT54S  [SOT23C(BAT54S)]  -26.92,-283.72 0 top  (outside the outline)
D8  BAT54S  [SOT23C(BAT54S)]  -17.02,-283.72 0 top  (outside the outline)
D9  BAT54S  [SOT23C(BAT54S)]  -7.11,-283.72 0 top  (outside the outline)
D10  BAT54S  [SOT23C(BAT54S)]  2.79,-283.72 0 top  (outside the outline)
FET2  BSS138  [SOT23]  12.7,-283.72 0 top  (outside the outline)
FET3  BSS138  [SOT23]  22.61,-283.72 0 top  (outside the outline)
FET4  BSS138  [SOT23]  32.51,-283.72 0 top  (outside the outline)
GND  TESTPADTESTPAD_40-ROUND  [TESTPAD_40-ROUND]  11.43,97.16 0 bottom
GND_PIN  TESTPAD3  [TEST_PAD40/70/SQUARE]  4.45,12.7 0 top
GPIO-1  BH26S  [ML26]  -50.8,-830.58 0 top  (outside the outline)
GPIO-2  BH40S  [ML40]  59.69,5.08 180 top
HOST_EN  Open  [SJ_1_SMALLER]  -24.26,-411.35 0 top  (outside the outline)
JTAG  BH20S  [ML20-MALE]  105.41,13.97 180 top
L1  FB0805/600R/2A  [L0805_5MIL_DWS]  32.13,-380.49 0 top  (outside the outline)
L2  FB0805/600R/2A  [L0805_5MIL_DWS]  -49.78,-392.56 0 top  (outside the outline)
L3  FB0805/600R/2A  [L0805_5MIL_DWS]  -39.75,-392.56 0 top  (outside the outline)
L4  CL470nH/0805/1.76R/250mA  [L0805_5MIL_DWS]  120.52,124.46 0 top
L5  FB0805/600R/2A  [L0805_5MIL_DWS]  -29.84,-392.56 0 top  (outside the outline)
L6  FB0805/600R/2A  [L0805_5MIL_DWS]  9.75,43.66 90 top
L7  FB0805/600R/200mA(201209-601)  [L0805_5MIL_DWS]  9.75,36.42 270 top
L8  FB0805/600R/2A  [L0805_5MIL_DWS]  -69.98,-443.99 0 top  (outside the outline)
L9  2.2uH/1.5A/DCR<0.1R/CD32  [CD32]  -58.67,280.92 0 top  (outside the outline)
L10  2.2uH/1.5A/DCR<0.1R/CD32  [CD32]  -58.67,304.42 0 top  (outside the outline)
L11  FB0805/600R/200mA(201209-601)  [L0805_5MIL_DWS]  -68.58,-534.67 0 top  (outside the outline)
L12  FB0805/600R/200mA(201209-601)  [L0805_5MIL_DWS]  -68.58,-542.29 0 top  (outside the outline)
L13  FB0805/600R/200mA(201209-601)  [L0805_5MIL_DWS]  -68.58,-563.88 0 top  (outside the outline)
L18  2.2uH/1.5A/DCR<0.1R/CD32  [CD32]  11.43,106.81 270 top
L19  10uH/3.15A/20%  [8X8MM_3131]  22.61,128.02 0 top
L21  2.2uH/1.5A/DCR<0.1R/CD32  [CD32]  39.34,112.88 0 top
L22  FB0805/600R/200mA(201209-601)  [L0805_5MIL_DWS]  -68.58,-119.38 0 top  (outside the outline)
L23  FB0805/600R/2A  [L0805_5MIL_DWS]  -19.81,-392.56 0 top  (outside the outline)
LAN  RJLBC-060TC1  [RJLBC-060TC1]  5.99,24.77 270 top
LCD_CON  BH40S  [ML40]  59.69,134.62 0 top
LED1  LED/GREEN/0603  [LED-0603]  2.29,112.65 0 top
NAND_E  NA(HN1x2(Close))  [JP1]  36.42,46.56 270 top
NMI  T1107A(6x3.8x2.5mm)  [SW-TAKT_6X3.5_SMD]  67.06,28.83 0 top
PWR  YDJ-1136  [PWR_JACK_UNI_MILLING]  7.75,122.28 0 top
PWR_LED  LED/RED/0603  [LED-0603]  2.29,105.54 0 top
Q1  Q25.000MHz/HC-49SM/SMD/20ppm/20pF  [HC49/SMD2_THIN]  40.92,36.45 0 top
Q2  32768Hz/6pF  [TC26H_3_REPAIR_SMD]  -49.53,-211.71 0 top  (outside the outline)
Q3  Q24.000MHz/HC-49SM/SMD/20ppm/20pF  [HC49/SMD2_THIN]  -35.56,-205.1 0 top  (outside the outline)
Q4  Q12.000MHz/HC-49SM/SMD/20ppm/20pF  [HC49/SMD2_THIN]  8.76,-382.27 0 top  (outside the outline)
R1  2k/1%  [R0603_5MIL_DWS]  95.63,46.02 270 top
R2  2k/1%  [R0603_5MIL_DWS]  91.06,46.02 90 top
R3  1k/1%  [R0603_5MIL_DWS]  -39.24,278.51 0 top  (outside the outline)
R4  49.9R/1%  [R0603_5MIL_DWS]  -68.58,-54.61 0 top  (outside the outline)
R5  NA  [R0603_5MIL_DWS]  97.31,46.02 270 top
R6  2k/1%  [R0603_5MIL_DWS]  98.83,46.02 270 top
R7  240R/1%  [R0603_5MIL_DWS]  99.59,107.21 270 top
R8  2k/1%  [R0603_5MIL_DWS]  103.4,46.02 90 top
R9  240R/1%  [R0603_5MIL_DWS]  101.88,92.74 270 top
R10  49.9R/1%  [R0603_5MIL_DWS]  -68.58,-60.96 0 top  (outside the outline)
R11  49.9R/1%  [R0603_5MIL_DWS]  -68.58,-67.31 0 top  (outside the outline)
R12  49.9R/1%  [R0603_5MIL_DWS]  -68.58,-73.66 0 top  (outside the outline)
R13  [0603_0R]  -68.58,-635 0 top  (outside the outline)
R14  4.7k  [R0603_5MIL_DWS]  -68.58,-190.5 0 top  (outside the outline)
R15  4.7k  [R0603_5MIL_DWS]  -68.58,-127 0 top  (outside the outline)
R16  49.9R/1%  [R0603_5MIL_DWS]  73.84,85.27 180 top
R17  0R(Board_Mounted)  [0603_0R]  -68.58,-177.8 0 top  (outside the outline)
R18  NA(10k)  [R0603_5MIL_DWS]  31.78,59.36 270 top
R19  NA(10k)  [R0603_5MIL_DWS]  30.25,56.72 90 top
R20  12.1k/1%  [R0603_5MIL_DWS]  26.06,21.59 90 top
R21  NA(10k)  [R0603_5MIL_DWS]  31.01,52.5 0 top
R22  560R  [R0603_5MIL_DWS]  18.95,17.53 0 top
R23  10k/1%  [R0603_5MIL_DWS]  -68.58,-237.49 0 top  (outside the outline)
R24  47k  [R0603_5MIL_DWS]  -68.58,-243.84 0 top  (outside the outline)
R25  NA  [R0603_5MIL_DWS]  40.67,30.1 270 top
R26  560R  [R0603_5MIL_DWS]  18.95,19.05 0 top
R27  17.8k/1%  [R0603_5MIL_DWS]  42.04,-282.45 0 top  (outside the outline)
R28  8.66k/1%  [R0603_5MIL_DWS]  -27.18,-291.21 0 top  (outside the outline)
R29  NA(1M)  [R0603_5MIL_DWS]  120.52,134.87 180 top
R30  10k  [R0603_5MIL_DWS]  120.52,133.35 180 top
R31  4.32k/1%  [R0603_5MIL_DWS]  -15.62,-291.21 0 top  (outside the outline)
R32  2.2k  [R0603_5MIL_DWS]  5.59,112.65 180 top
R33  10k  [R0603_5MIL_DWS]  120.52,136.4 180 top
R34  2.2k/1%  [R0603_5MIL_DWS]  -4.06,-291.21 0 top  (outside the outline)
R35  NA  [R0603_5MIL_DWS]  -68.58,-316.23 0 top  (outside the outline)
R36  1.1k/1%  [R0603_5MIL_DWS]  7.49,-291.21 0 top  (outside the outline)
R37  1.1k/1%  [R0603_5MIL_DWS]  19.05,-291.21 0 top  (outside the outline)
R38  NA  [R0603_5MIL_DWS]  -68.58,-322.58 0 top  (outside the outline)
R39  1.05k/1%  [R0603_5MIL_DWS]  30.61,-291.21 0 top  (outside the outline)
R40  549R/1%  [R0603_5MIL_DWS]  42.16,-291.21 0 top  (outside the outline)
R41  NA  [R0603_5MIL_DWS]  -68.58,-328.93 0 top  (outside the outline)
R42  1k/1%  [R0603_5MIL_DWS]  24.08,41.61 90 top
R43  1.2k/1%  [R0603_5MIL_DWS]  -58.93,289.56 0 top  (outside the outline)
R44  10k  [R0603_5MIL_DWS]  31.47,41.61 270 top
R45  13k/1%  [R0603_5MIL_DWS]  25.6,41.61 270 top
R46  NA  [R0603_5MIL_DWS]  -57.02,456.18 0 top  (outside the outline)
R47  10k  [R0603_5MIL_DWS]  -23.88,178.31 0 top  (outside the outline)
R48  120R  [R1206_5MIL_WS]  -41.4,178.56 0 top  (outside the outline)
R49  NA  [R0603_5MIL_DWS]  85.42,119.41 270 top
R50  NA  [R0603_5MIL_DWS]  86.94,119.41 270 top
R51  1.2k/1%  [R0603_5MIL_DWS]  -39.24,302.01 0 top  (outside the outline)
R52  47k  [R0603_5MIL_DWS]  11.58,36.42 90 top
R53  1.1k/1%  [R0603_5MIL_DWS]  -58.93,313.06 0 top  (outside the outline)
R54  NA  [R0603_5MIL_DWS_NA]  -12.32,178.18 0 top  (outside the outline)
R55  22R  [R0603_5MIL_DWS]  -68.58,-615.95 0 top  (outside the outline)
R56  NA  [R0603_5MIL_DWS]  -68.58,-622.3 0 top  (outside the outline)
R57  22R  [R0603_5MIL_DWS]  -68.58,-628.65 0 top  (outside the outline)
R58  10k  [R0603_5MIL_DWS]  -57.02,477.27 0 top  (outside the outline)
R59  47k  [R0603_5MIL_DWS]  -68.58,-641.35 0 top  (outside the outline)
R60  17.8k/1%  [R0603_5MIL_DWS]  -27.18,-297.43 0 top  (outside the outline)
R61  47k  [R0603_5MIL_DWS]  -68.58,-654.05 0 top  (outside the outline)
R62  NA  [R0603_5MIL_DWS_NA]  -68.58,-819.15 0 top  (outside the outline)
R63  10k(NA)  [R0603_5MIL_DWS]  -57.02,513.21 0 top  (outside the outline)
R64  8.66k/1%  [R0603_5MIL_DWS]  -15.62,-297.43 0 top  (outside the outline)
R65  10k  [R0603_5MIL_DWS]  -68.58,-675.64 0 top  (outside the outline)
R66  4.32k/1%  [R0603_5MIL_DWS]  -4.06,-297.43 0 top  (outside the outline)
R68  2.2k/1%  [R0603_5MIL_DWS]  7.49,-297.43 0 top  (outside the outline)
R71  6.8k/1%  [R0603_5MIL_DWS]  -10.29,-392.3 0 top  (outside the outline)
R72  10k  [R0603_5MIL_DWS]  1.27,-392.3 0 top  (outside the outline)
R74  680R/1%  [R0603_5MIL_DWS]  12.83,-392.3 0 top  (outside the outline)
R77  4.99k/1%  [R0603_5MIL_DWS]  10.67,112.65 0 top
R78  3.3k/1%  [R0603_5MIL_DWS]  15.62,112.65 0 top
R79  47k  [R0603_5MIL_DWS]  12.7,134.24 0 top
R80  4.99k/1%  [R0603_5MIL_DWS]  16.74,138.43 180 top
R81  2.2k  [R0603_5MIL_DWS]  5.59,105.54 180 top
R82  2.2k  [R0603_5MIL_DWS]  -68.58,-751.84 0 top  (outside the outline)
R83  2.2k  [R0603_5MIL_DWS]  -68.58,-758.19 0 top  (outside the outline)
R85  2.2k  [R0603_5MIL_DWS]  12.7,137.29 0 top
R86  1k/1%  [R0603_5MIL_DWS]  20.02,138.43 0 top
R87  0R(Board_Mounted)  [0603_0R]  10.67,115.7 0 top
R89  4.99k/1%  [R0603_5MIL_DWS]  32.69,112.24 90 top
R91  10k  [R0603_5MIL_DWS]  74.17,21.72 180 top
R92  1.1k/1%  [R0603_5MIL_DWS]  32.69,116.08 90 top
R93  2.2k  [R0603_5MIL_DWS]  98.53,119.33 270 top
R94  2.2k  [R0603_5MIL_DWS]  100.05,119.33 270 top
R95  47k  [R0603_5MIL_DWS]  103.71,119.33 270 top
R96  1k/1%  [R0603_5MIL_DWS]  70.87,23.24 180 top
R106  1.05k/1%  [R0603_5MIL_DWS]  19.05,-297.43 0 top  (outside the outline)
R107  549R/1%  [R0603_5MIL_DWS]  30.61,-297.43 0 top  (outside the outline)
R108  17.8k/1%  [R0603_5MIL_DWS]  42.16,-297.43 0 top  (outside the outline)
R109  8.66k/1%  [R0603_5MIL_DWS]  -27.18,-303.66 0 top  (outside the outline)
R110  4.32k/1%  [R0603_5MIL_DWS]  -15.62,-303.66 0 top  (outside the outline)
R111  2.2k/1%  [R0603_5MIL_DWS]  -4.06,-303.66 0 top  (outside the outline)
R112  1.05k/1%  [R0603_5MIL_DWS]  7.49,-303.66 0 top  (outside the outline)
R113  549R/1%  [R0603_5MIL_DWS]  19.05,-303.66 0 top  (outside the outline)
R114  NA  [R0603_5MIL_DWS]  -68.58,-335.28 0 top  (outside the outline)
R115  NA  [R0603_5MIL_DWS]  -68.58,-341.63 0 top  (outside the outline)
R116  51R  [R0603_5MIL_DWS]  -27.18,-309.88 0 top  (outside the outline)
R117  51R  [R0603_5MIL_DWS]  -15.62,-309.88 0 top  (outside the outline)
R118  22R  [R0603_5MIL_DWS]  83.06,76.68 180 top
R119  22R  [R0603_5MIL_DWS]  83.06,78.21 180 top
R120  51R  [R0603_5MIL_DWS]  -4.06,-309.88 0 top  (outside the outline)
R121  1.1k/1%  [R0603_5MIL_DWS]  7.49,-309.88 0 top  (outside the outline)
R122  NA  [R0603_5MIL_DWS]  -68.58,-347.98 0 top  (outside the outline)
R123  47k  [R0603_5MIL_DWS]  24.38,-392.3 0 top  (outside the outline)
R124  NA(47k)  [R0603_5MIL_DWS]  35.94,-392.3 0 top  (outside the outline)
R125  10k  [R0603_5MIL_DWS]  -50.16,-399.03 0 top  (outside the outline)
R126  NA(5.1k)  [R0603_5MIL_DWS]  -38.61,-399.03 0 top  (outside the outline)
R127  NA(10k)  [R0603_5MIL_DWS]  -27.05,-399.03 0 top  (outside the outline)
R128  10k  [R0603_5MIL_DWS]  -15.49,-399.03 0 top  (outside the outline)
R129  NA  [R0603_5MIL_DWS]  -3.94,-399.03 0 top  (outside the outline)
R154  NA  [R0603_5MIL_DWS_NA]  -2.03,178.18 0 top  (outside the outline)
RM12  RA1206_(4X0603)_4B8_4.7k  [R_MATRIX_4]  36.86,30.1 180 top
RM14  RA1206_(4X0603)_4B8_100K  [R_MATRIX_4]  120.52,130.56 0 top
RM25  RA1206_(4X0603)_4B8_10k  [R_MATRIX_4]  107.44,20.19 90 top
RM26  RA1206_(4X0603)_4B8_10k  [R_MATRIX_4]  103.38,20.19 270 top
RST  T1107A(6x3.8x2.5mm)  [SW-TAKT_6X3.5_SMD]  -69.98,466.73 0 top  (outside the outline)
SD/MMC1  MICRO_SD+CP  [TFR-MEM-CON]  123.7,130.68 270 top
T1  DTA114YKA  [SOT-23]  -64.77,-668.02 0 top  (outside the outline)
TP1-USBCE  TESTPADTESTPAD_40-ROUND  [TESTPAD_40-ROUND]  -68.58,-571.5 0 top  (outside the outline)
TP2  TESTPADTESTPAD_40-ROUND  [TESTPAD_40-ROUND]  -68.58,-577.85 0 top  (outside the outline)
TP3  TESTPADTESTPAD_40-ROUND  [TESTPAD_40-ROUND]  -68.58,-584.2 0 top  (outside the outline)
TP4  TESTPADTESTPAD_40-ROUND  [TESTPAD_40-ROUND]  -68.58,-660.4 0 top  (outside the outline)
U1  AM3352ZCZD72  [S-PBGA-N324]  -60.96,-21.59 0 top  (outside the outline)
U2  H5TQ2G83CFR-H9C  [FBGA78]  99.19,100.23 90 top
U3  H5TQ2G83CFR-H9C  [FBGA78]  99.19,85.21 90 top
U4  LAN8710A-EZC  [QFN-32]  -67.31,-45.72 0 top  (outside the outline)
U5  SN74ALVC244  [PW]  17.02,-259.71 0 top  (outside the outline)
U6  SN74ALVC244  [PW]  29.59,-259.71 0 top  (outside the outline)
U7  SN74ALVC244  [PW]  42.16,-259.59 0 top  (outside the outline)
U8  NA(H27UBG8T2BTR)  [TSOP48]  43.61,54.91 270 top
U9  SY6280  [SOT23-5]  28.57,41.61 270 top
U10  SN65HVD230(SO8)  [SO-08]  -3.94,156.34 0 top  (outside the outline)
U11  SY8009AAAC  [SOT23-5]  -48.9,279.91 0 top  (outside the outline)
U12  SY8009AAAC  [SOT23-5]  -48.9,303.4 0 top  (outside the outline)
U13  SY8009AAAC  [SOT23-5]  15.11,109.98 270 top
U14  MP1482DS  [SOIC8]  18.29,135 90 top
U15  SY8009AAAC  [SOT23-5]  35.36,116.08 0 top
U16  MCP130T-300I/TT  [SOT23]  -56.77,505.71 0 top  (outside the outline)
U17  SY6280  [SOT23-5]  22.1,-381.63 0 top  (outside the outline)
U19  FIDUCIAL1X2  [FIDUCIAL-1X2]  2.54,2.54 180 top
U20  FIDUCIAL1X2  [FIDUCIAL-1X2]  137.16,2.54 180 top
U21  FIDUCIAL1X2  [FIDUCIAL-1X2]  2.54,133.35 180 top
U22  GL850G-HHGXX  [SSOP28]  10.54,-358.14 0 top  (outside the outline)
U$1  NANO_ITX_  [NANO-ITX_140X140]  0,0 0 top
U$5  [LOGO-OPENHARDWARE_8X8]  16.38,5.71 0 top
U$6  [OLIMEX1_V]  46.99,107.95 0 bottom
U$8  [OLIMEX1_V]  79.25,116.08 0 top
U$9  [PB]  24.51,5.71 0 top
U$10  [ESD_SYMBOL]  4.19,2.67 0 top
U$11  [RECYCLE_BIN1/8]  113.41,0.51 0 top
U$12  [ROHS]  121.79,1.27 0 top
UEXT1  BH10S  [ML10-MALE]  99.06,134.62 0 top
USB_HOST1  USB_A_VERTICAL  [USB_A_VERTICAL_PTH]  -48.01,-376.94 0 top  (outside the outline)
USB_HOST2  USB_A_VERTICAL  [USB_A_VERTICAL_PTH]  -29.08,-376.94 0 top  (outside the outline)
USB_HOST3  USB_A_VERTICAL  [USB_A_VERTICAL_PTH]  -10.16,-376.94 0 top  (outside the outline)
USB_HOST4  USB_A_VERTICAL  [USB_A_VERTICAL_PTH]  -68.33,-440.44 0 top  (outside the outline)
USB_OTG  USB-OTG  [USB_MINI_9PIN]  4.45,40.39 0 top
VGA_DB15-F1  VGA15  [DB15-F_22MM]  -10.16,-265.68 0 top  (outside the outline)
VR1  AP1231-2.5V(SOT23-5)  [SOT-23-5]  20.98,109.12 180 top

## Tracks (layer width: path | path; a pad name or v marks a point on that pad's centre or on a via)
#OVCUR1  (2 unrouted)
+5V  (via drill 0.4, 0.6)  (25 unrouted)
  Top 0.203: 31.09,96.83 30.83,97.08 | 34.25,102.22 34.98,102.95 v35.23,102.95 | 34.6,99.02 34.65,99.06 34.29,99.42 | 29.23,105.16 29.01,105.16 28.83,105.16 | 26.61,102.22 25.91,102.92 25.91,103.07 | 26.16,100.46 26.32,100.62
  Top 0.254: C207.1 38.35,117.37 44.17,117.37
  Top 0.305: U9.5 30.15,42.55 C125.1
  Top 0.406: 23.7,104.8 v24.38,104.8 v25.3,104.8 25.91,104.19 25.91,103.07
  Top 0.508: 29.46,132.16 5V_E.2 | 26.16,100.46 v26.11,100.41 v25.68,99.97
  Top 0.61: v31.01,44.2 C125.1 | v121.31,88.77 120.94,88.77 | 120.91,84.73 v121.31,84.73 123.77,84.73 124.54,85.5 v128.09,85.5 | 33.91,133.35 33.91,138.46 34.44,138.99 136.47,138.99 v136.63,138.84 | v18.03,109.55 17.52,109.03 | 31.09,96.83 31.09,95.4 v30.94,95.25 30.84,95.15 30.84,94.44 | v35.23,102.95 35.92,102.95 | 38.91,98.04 37.9,99.06 v36.2,99.06 v35.59,99.06 34.65,99.06 | 27.86,106.15 v28.35,105.66 28.85,105.16 29.01,105.16 | 24.89,97.33 v25.6,97.33 v25.6,97.94 | C207.1 36.31,117.75 U15.4
  Top 0.762: 29.5,133.35 29.5,132.19 29.46,132.16
  Top 0.813: v17.75,81.84 16.79,81.84 | 16.18,87.68 17.75,86.11 v17.75,81.84 | 85.5,6.35 GPIO-2.1 | 85.5,6.35 85.5,13.56 | 85.5,6.35 v85.5,1.5 104.22,1.5 105.84,3.12 105.84,5.21 104.7,6.35 | v17.75,81.84 21.18,81.84 22.1,80.92 v22.1,78.79
  Top 1.016: 34.87,124.46 33.91,125.42 33.91,133.35 | 35.59,133.35 LCD_CON.1 33.91,133.35 | 33.91,133.35 29.5,133.35 | 28.73,115.03 28.73,113.54 v28.35,113.16 | v29.97,119 30.23,119.25 37.34,119.25 37.97,118.62 C207.1
  Route15 0.254: v3.17,110.24 4.37,109.04 17.53,109.04 v18.03,109.55
  Route15 0.813: 26.59,100.89 27.74,102.03 27.74,105.05 v28.35,105.66 | 26.59,100.89 v25.68,99.97 | 30.94,98.45 v30.94,95.25 | 30.94,98.45 29.03,98.45 26.59,100.89 | 30.94,98.45 34.98,98.45 v35.59,99.06 v36.2,99.06
  Bottom 0.203: v25.6,97.33 25.43,97.16
  Bottom 0.508: 15.47,97.16 +5V.1
  Bottom 0.61: v121.31,84.73 v121.31,88.77 | v136.63,138.84 138.15,138.84 138.99,138 138.99,92.35 132.13,85.5 v128.09,85.5 | v26.11,100.41 25.6,99.9 v25.6,97.94 v25.6,97.33
  Bottom 0.813: 24.05,56.69 v24.28,56.69 | 24.05,56.69 v24.05,70.18 24.05,76.83 v22.1,78.79 | 24.05,44.2 24.05,56.69 | 24.05,44.2 v31.01,44.2 | 15.47,87.99 15.47,97.16 15.47,108.64 18.44,111.61 18.44,113.31 29.59,124.46 | 24.05,44.2 24.05,42.88 11.05,29.87 11.05,21.34 30.89,1.5 v85.5,1.5 | v28.35,105.66 27.79,105.11 25.6,105.11 v25.3,104.8 v24.38,104.8 | v35.59,99.06 35.89,99.06 | 35.89,99.06 35.89,102.49 35.43,102.95 v35.23,102.95 | v36.2,99.06 35.89,99.06
  Bottom 1.016: v29.97,119 28.35,117.37 v28.35,113.16 28.35,106.83 | 28.35,106.83 v28.35,105.66 | v18.03,109.55 20.75,106.83 28.35,106.83
+5V_CAN  (1 unrouted)
+5V_JTAG
  Top 0.254: RM26.4.2 102.11,17.73 101.4,17.02 95.76,17.02 95.43,16.69
  Top 0.914: JTAG.19 95.43,16.69
+5V_OTG_PWR  (via drill 0.4, 0.6)
  Top 0.203: 30.68,105.13 30.43,104.88
  Top 0.508: 30.68,106.05 v30.68,105.77 v30.68,105.16 30.68,105.13
  Top 0.61: USB_OTG.VBUS 9.09,41.99 L6.1 9.88,42.77 C124.1 v12.57,42.77
  Bottom 0.61: 30.58,105.16 v30.68,105.16 v30.68,105.77
  Bottom 0.813: 30.58,105.16 27.13,101.7 27.13,99.97 26.59,99.44 26.59,96.77 26.14,96.32 26.14,91.9 14.63,80.39 14.63,66.6 16.69,64.54 16.69,48.39 13.64,45.34 13.64,43.84 v12.57,42.77
+15V  (via drill 0.4, 0.6)  (1 unrouted)
  Top 0.203: 30.03,105.18 29.84,105.18 29.63,105.18
  Top 0.508: 28.32,132.16 5V_E.1
  Top 0.61: v29.64,105.97 29.84,105.77 29.84,105.18 | v6.48,106.38 R81.1
  Top 1.016: 24.77,136.47 C205.1 C204.1 v25.81,138.43 | 24.77,136.47 24.77,134.11 | 25.71,132.16 25.68,132.16 24.61,133.23 | 24.77,136.47 26.61,136.47 | 25.71,132.16 L19.2 25.71,125.53 29.03,125.53 31.24,123.32 v31.24,120.55 | 25.71,132.16 28.32,132.16 | v14.86,138.43 R80.2
  Route15 0.203: v6.48,106.38 18.21,106.38 v20.57,104.01
  Bottom 0.203: v29.64,105.97 29.64,105.69 28.35,104.39 26.06,104.39 25.68,104.01 v20.57,104.01 | v6.48,106.38 13.97,98.88 5VEXT.1
  Bottom 0.813: v31.24,120.55 31.24,118.49 29.64,116.89 v29.64,105.97
  Bottom 1.016: v14.86,138.43 16.13,137.16 24.54,137.16 v25.81,138.43
AIN4  (2 unrouted)
AIN5  (2 unrouted)
AIN6  (2 unrouted)
AIN7  (2 unrouted)
AVDD1  (6 unrouted)
BA0  (via drill 0.25)  (1 unrouted)
  Top 0.127: 101.19,51.38 101.19,51.81 102.44,53.06 105.11,53.06 105.13,53.09 | 101.19,66.41 101.19,66.82 102.46,68.1 106.58,68.1 106.6,68.12 | 101.19,83.41 101.19,83.83 102.45,85.09 106.73,85.09 106.76,85.06 | 101.19,98.43 101.19,98.88 102.41,100.1 106.73,100.1 106.76,100.08
  Top 0.152: 101.19,51.38 101.19,51.18 | 101.19,66.41 101.19,66.2 | v106.91,55.85 106.83,55.85 106.45,55.47 106.45,54.41 105.13,53.09 | 106.6,68.12 108.74,70.26 108.74,71.78 v108.89,71.93 | U3.J2 101.19,83.2 101.19,83.41 | U2.J2 101.19,98.23 101.19,98.43 | v108.89,83.9 107.92,83.9 106.76,85.06 | 106.76,100.08 107.92,98.91 v108.89,98.91 | v95.1,72.92 95.25,73.08 101.65,73.08 103.63,75.06 109.04,75.06 v109.19,74.91
  Bottom 0.152: v106.91,55.85 106.98,55.85 108.58,57.45 108.58,64.39 108.74,64.54 108.74,71.78 v108.89,71.93 109.04,72.08 109.04,74.75 v109.19,74.91 109.35,75.06 109.35,75.82 109.04,76.12 109.04,79.55 108.74,79.86 108.74,83.74 v108.89,83.9 109.04,84.05 109.04,87.5 108.74,87.81 108.74,98.75 v108.89,98.91 | v77.99,69.61 78.29,69.61 78.56,69.88 84.63,69.88 87.53,72.77 94.94,72.77 v95.1,72.92
BA1  (via drill 0.25)  (1 unrouted)
  Top 0.152: v101.29,87.91 U3.K8 | v101.29,102.93 U2.K8 | v93.5,73.84 93.65,73.99 96.24,73.99 96.55,73.69 101.12,73.69 v101.42,73.99
  Bottom 0.152: 101.42,70.91 101.42,69.93 101.73,69.62 101.73,56.32 v101.29,55.88 | 101.42,87.91 101.73,88.21 101.73,101.62 101.42,101.93 101.42,102.8 v101.29,102.93 | 101.42,70.91 101.73,71.21 101.73,73.69 v101.42,73.99 101.42,77.5 101.73,77.8 101.73,86.49 101.42,86.79 101.42,87.91 | 101.42,70.91 v101.29,70.91 | 101.42,87.91 v101.29,87.91 | v77.19,70.41 77.65,70.87 78.26,70.87 78.33,70.79 84.25,70.79 87.15,73.69 93.34,73.69 v93.5,73.84
BA2  (via drill 0.25)  (1 unrouted)
  Top 0.127: 100.79,51.82 102.29,53.31 104.93,53.31 104.95,53.34 | 100.79,66.83 102.31,68.35 106.4,68.35 106.43,68.38 | U3.J3 100.79,83.85 102.29,85.34 106.91,85.34 106.93,85.32 | U2.J3 100.79,98.89 102.26,100.36 106.91,100.36 106.93,100.33
  Top 0.152: v106.91,56.46 106.83,56.46 106.15,55.78 106.15,54.53 104.95,53.34 | v108.58,72.47 108.43,72.31 108.43,70.38 106.43,68.38 | v108.58,84.43 107.82,84.43 106.93,85.32 | v108.58,99.44 107.82,99.44 106.93,100.33 | v94.56,73.23 94.72,73.38 101.5,73.38 103.48,75.36 108.74,75.36 v108.89,75.51
  Bottom 0.127: 77.74,70 78.24,70
  Bottom 0.152: v106.91,56.46 106.98,56.46 108.28,57.76 108.28,64.52 108.43,64.67 108.43,72.31 v108.58,72.47 108.74,72.62 108.74,75.51 | v108.58,99.44 108.43,99.29 108.43,87.63 108.74,87.33 108.74,84.58 v108.58,84.43 108.43,84.28 108.43,79.7 108.74,79.4 108.74,75.51 | v77.19,69.61 77.59,70 77.74,70 | v108.89,75.51 108.74,75.51 | 78.24,70 78.26,70 78.44,70.18 84.51,70.18 87.4,73.08 94.41,73.08 v94.56,73.23
CAN0_RX  (1 unrouted)
CAN0_TX  (1 unrouted)
CANH  (2 unrouted)
CANL  (2 unrouted)
CASN  (via drill 0.25)  (1 unrouted)
  Top 0.127: 99.33,51.58 101.83,54.08 104.39,54.08 104.42,54.1 | 99.35,66.61 101.85,69.11 105.87,69.11 105.89,69.14 | U3.G3 99.33,83.61 101.83,86.11 107.59,86.11 | U2.G3 99.29,98.63 101.78,101.12 107.59,101.12
  Top 0.152: v106.91,58.29 106.83,58.29 105.23,56.69 105.23,54.91 104.42,54.1 | v107.67,74.07 107.52,73.91 107.52,70.76 105.89,69.14 | v107.67,86.11 107.59,86.11 | v107.67,101.12 107.59,101.12 | v90.83,78.26 90.98,78.11 106.53,78.11 106.83,78.41 107.44,78.41 v107.67,78.18
  Bottom 0.152: v106.91,58.29 106.98,58.29 107.37,58.67 107.37,64.9 107.52,65.05 107.52,73.91 v107.67,74.07 107.82,74.22 107.82,74.83 107.52,75.13 107.52,78.18 | v107.67,101.12 107.52,100.97 107.52,87.17 107.82,86.87 107.82,86.26 v107.67,86.11 107.52,85.95 107.52,78.18 | v77.99,76 78.47,76 80.87,78.41 90.68,78.41 v90.83,78.26 | v107.67,78.18 107.52,78.18
CKE  (via drill 0.25)  (1 unrouted)
  Top 0.152: v99.21,56.97 99.21,56.4 | v99.21,71.86 99.21,71.43 | U3.G9 99.21,88.43 v99.21,88.92 | v99.19,104.03 U2.G9 | v99.21,76.43 98.91,76.12 97.77,76.12 97.46,76.43 87.38,76.43
  Bottom 0.152: 99.14,88.92 99.14,100.84 99.36,101.07 99.36,101.47 99.14,101.7 99.14,103.98 v99.19,104.03 | 99.14,88.92 99.14,86.92 99.36,86.69 99.36,86.21 99.06,85.9 99.06,76.43 | 99.06,71.86 99.06,76.43 | 99.06,71.86 99.06,70 99.36,69.7 99.36,65.84 99.14,65.61 99.14,65.15 99.36,64.92 99.36,57.12 v99.21,56.97 | 99.06,71.86 v99.21,71.86 | 99.14,88.92 v99.21,88.92 | 99.06,76.43 v99.21,76.43
CLK  (via drill 0.25)
  Top 0.127: R118.1 84.61,77.34 88.7,77.34 89.23,76.81 97.92,76.81 v98.07,76.66 | v98.3,54.18 98.39,54.27 | v98.3,69.19 98.39,69.28 | U3.F7 98.39,86.27 v98.3,86.18 | U2.F7 98.39,101.36 v98.3,101.27
  Bottom 0.127: 98.45,69.19 98.45,54.33 v98.3,54.18 | 98.45,69.19 v98.3,69.19 | 98.45,86.18 v98.3,86.18 | 98.45,86.18 98.45,77.47 98.15,77.17 98.15,76.66 | 98.15,76.66 v98.07,76.66 | 98.15,76.66 98.45,76.35 98.45,69.19 | v98.3,101.27 98.45,101.12 98.45,86.18
CLKN  (via drill 0.25)
  Top 0.127: R119.1 84.51,77.65 88.85,77.65 89.38,77.11 98.45,77.11 v98.6,76.96 | v98.91,54.42 98.91,54.5 | 99.19,69.78 98.91,69.49 v98.91,69.44 | U3.G7 98.91,86.52 v98.91,86.45 | U2.G7 98.91,101.55 v98.91,101.27
  Bottom 0.127: v98.91,54.42 98.75,54.57 98.75,69.44 | 98.75,76.96 98.75,86.45 | 98.75,69.44 98.75,76.96 | v98.91,101.27 98.75,101.12 98.75,86.45 | 98.75,86.45 v98.91,86.45 | 98.75,69.44 v98.91,69.44 | 98.75,76.96 v98.6,76.96
CPU-REF  (via drill 0.25, 0.3, 0.4)  (1 unrouted)
  Top 0.305: v89.23,47.7 89.23,47.22 C71.2
  Top 0.508: v97.31,44.27 R5.2 97.31,45.19 95.63,46.86 R1.1
  Top 0.61: R1.1 C1.2 C12.2 R2.2 C71.2
  Bottom 0.127: 75.99,77.36 75.99,77.86 | 73.59,77.36 73.59,77.86 | 73.99,79.02 73.59,78.62 73.59,78.16 | 76.64,68.41 76.14,68.41
  Bottom 0.152: v76.39,78.41 75.99,78 75.99,77.86 | 73.59,77.86 73.59,78.16 | 73.59,77.36 73.59,77.28 73.77,77.11 75.89,77.11 | 73.99,79.02 v73.99,79.2 | 75.99,77.36 75.99,77.33 75.89,77.23 75.89,77.11 | 75.89,77.11 75.89,68.61 76.09,68.41 76.14,68.41 | 76.64,68.41 76.79,68.41 v77.19,68
  Bottom 0.203: v77.19,68 v77.99,68 78.56,67.43 78.56,66.82 81.13,64.26 81.13,56.31 89.23,48.21 v89.23,47.7
DDR3_ODT  (via drill 0.25, 0.25 pad 0.25)  (1 unrouted)
  Top 0.152: 99.19,96.39 U2.G1 | 99.19,96.39 100.43,96.39 v100.89,95.94 | v100.66,64.16 100.03,64.16 | v88.09,94.94 87.38,94.94 | 99.19,96.39 v97.99,96.39 | v100.58,81.38 100.43,81.53 99.66,81.53 U3.G1
  Bottom 0.152: v98.89,49.68 98.89,52.94 100.97,55.02 100.97,55.47 100.81,55.63 100.81,57.68 101.12,57.99 101.12,62.66 100.81,62.97 100.81,64.16 | 100.81,64.16 100.81,69.95 100.97,70.1 100.97,70.56 100.81,70.71 100.81,71.32 100.43,71.7 100.43,80.8 100.51,80.87 100.51,81.31 v100.58,81.38 100.66,81.46 100.66,86.79 100.97,87.1 100.97,87.48 100.74,87.71 100.74,95.78 v100.89,95.94 | 100.81,64.16 v100.66,64.16 | v88.09,94.94 96.55,94.94 v97.99,96.39
DDR3_RST  (via drill 0.25)  (1 unrouted)
  Top 0.127: v105.08,50.52 104.6,50.52 104.34,50.78 | 105.61,65.81 105.88,65.53 v106.3,65.53 | U3.N2 105.76,82.81 106.05,82.53 v106.45,82.53 | U2.N2 105.75,97.83 106.05,97.54 v106.45,97.54
  Top 0.152: v88.01,94.03 87.68,94.03
  Bottom 0.152: v105.08,50.52 105.23,50.67 105.23,54.48 106.15,55.4 106.15,65.38 v106.3,65.53 106.6,65.84 106.6,75.29 106.3,75.59 106.3,76.5 106.6,76.81 106.6,77.27 106.3,77.57 106.3,79.7 106.6,80.01 106.6,80.77 106.3,81.08 106.3,82.37 v106.45,82.53 106.6,82.68 106.6,89.38 106.3,89.69 106.3,97.38 v106.45,97.54 106.6,97.69 106.6,102.18 104.24,104.55 93.19,104.55 87.63,98.98 87.63,94.41 v88.01,94.03
DM1  (1 unrouted)
DM2  (1 unrouted)
DM3  (1 unrouted)
DM4  (1 unrouted)
DP1  (1 unrouted)
DP2  (1 unrouted)
DP3  (1 unrouted)
DP4  (1 unrouted)
DQ0  (1 unrouted)
  Top 0.127: U2.B3 95.19,98.47 94.95,98.23 94.11,98.23
  Top 0.152: 83.66,85.78 84.25,85.19 88.06,85.19 89.99,87.12 89.99,88.77 91.67,90.45 91.67,94.34 91.75,94.41 92.28,94.41 92.43,94.56 92.43,95.17 92.28,95.33 91.75,95.33 91.67,95.4 91.67,95.56 91.75,95.63 93.65,95.63 93.73,95.56 93.73,95.22 93.8,95.15 93.95,95.15 94.03,95.22 94.03,96.42 93.9,96.55 92.35,96.55 92.28,96.62 92.28,96.77 92.35,96.85 93.42,96.85 93.5,96.93 93.5,98.15 93.58,98.23 94.11,98.23
DQ1  (1 unrouted)
  Top 0.127: 95.83,101.09 95.99,101.25 U2.C7
  Top 0.152: 83.62,88.52 84.12,89.03 84.12,90.37 84.43,90.68 88.77,90.68 88.92,90.83 88.92,92.28 88.32,92.89 88.32,93.19 88.92,93.8 88.92,95.61 88.82,95.71 88.47,95.71 88.39,95.78 88.39,95.94 88.47,96.01 88.85,96.01 88.92,96.09 88.92,96.24 88.85,96.32 88.32,96.32 88.24,96.39 88.24,96.55 88.32,96.62 88.85,96.62 88.92,96.7 88.92,97.23 92.79,101.09 95.83,101.09
DQ2  (1 unrouted)
  Top 0.127: U2.C2 95.99,98.03 95.59,98.43 95.59,98.82 95.35,99.06 95.33,99.06
  Top 0.152: 83.59,86.28 84.38,85.5 87.94,85.5 89.69,87.25 89.69,88.9 91.36,90.58 91.36,94.49 91.59,94.72 91.95,94.72 92.02,94.79 92.02,94.94 91.95,95.02 91.59,95.02 91.36,95.25 91.36,95.71 91.59,95.94 93.65,95.94 93.73,96.01 93.73,96.16 93.65,96.24 92.2,96.24 91.97,96.47 91.97,96.93 92.2,97.16 93.1,97.16 93.19,97.24 93.19,98.48 93.78,99.06 95.33,99.06
DQ3  (1 unrouted)
  Top 0.127: U2.C8 95.89,102.63 95.59,102.33 95.59,101.61 95.38,101.4
  Top 0.152: 83.66,89.02 83.82,89.18 83.82,90.53 84.28,90.98 87.94,90.98 88.62,91.67 88.62,92.13 88.01,92.73 88.01,93.34 88.62,93.95 88.62,95.1 87.94,95.78 87.94,96.67 92.66,101.4 95.38,101.4
DQ4  (via drill 0.25)  (1 unrouted)
  Top 0.152: 83.5,89.52 83.52,89.53 83.52,90.68 84.12,91.29 87.81,91.29 88.16,91.64 v88.16,91.9 | U2.E3 98.3,99.34 98.3,100.03 97.97,100.36 97.36,100.36 97.23,100.48 93.04,100.48 89.53,96.98 89.53,93.27 v89.38,93.12
  Bottom 0.152: v88.16,91.9 v89.38,93.12
DQ5  (via drill 0.25)  (1 unrouted)
  Top 0.127: U2.E8 97.19,102.23 97.19,101.18 97.1,101.09 96.7,101.09 v96.44,101.35
  Top 0.152: 83.53,86.78 84.51,85.8 87.81,85.8 89.38,87.38 89.38,89.03 91.06,90.7 91.06,96.47 92.2,97.61 v92.73,97.61